# EAGLE design A20_Linux (EAGLE 6.5.0)
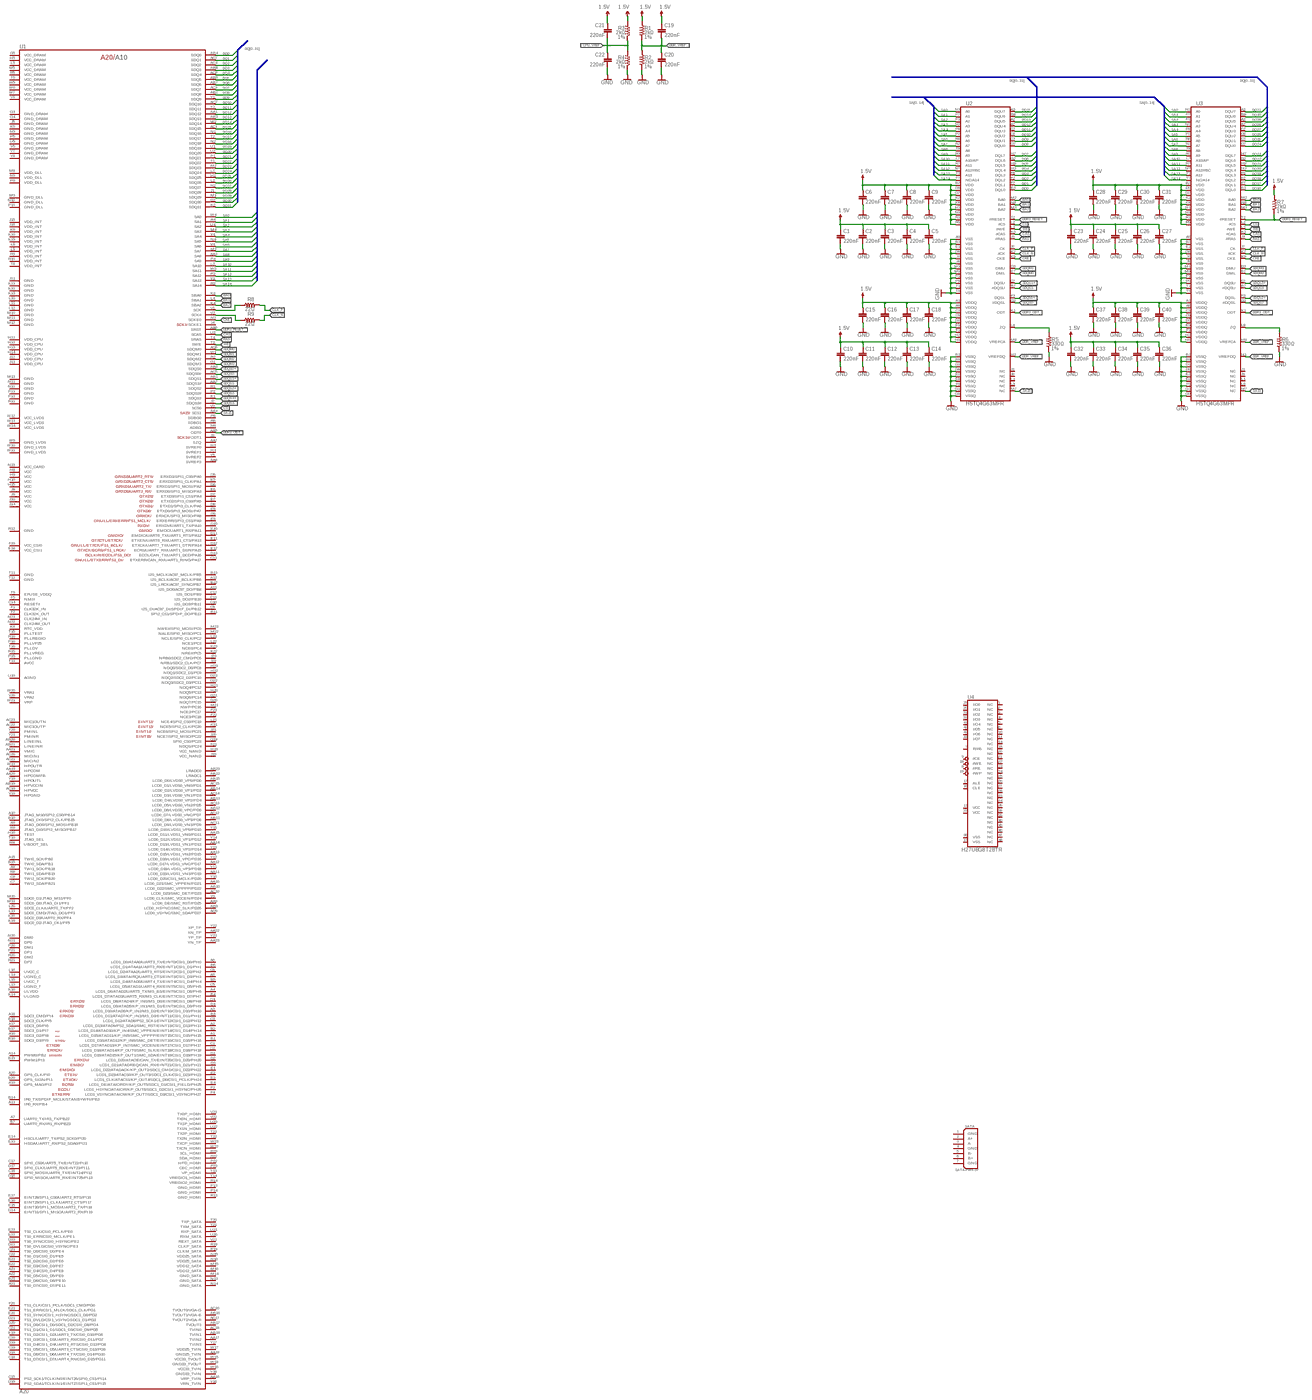
[diagram p0: schematic, sheet 1, overview]
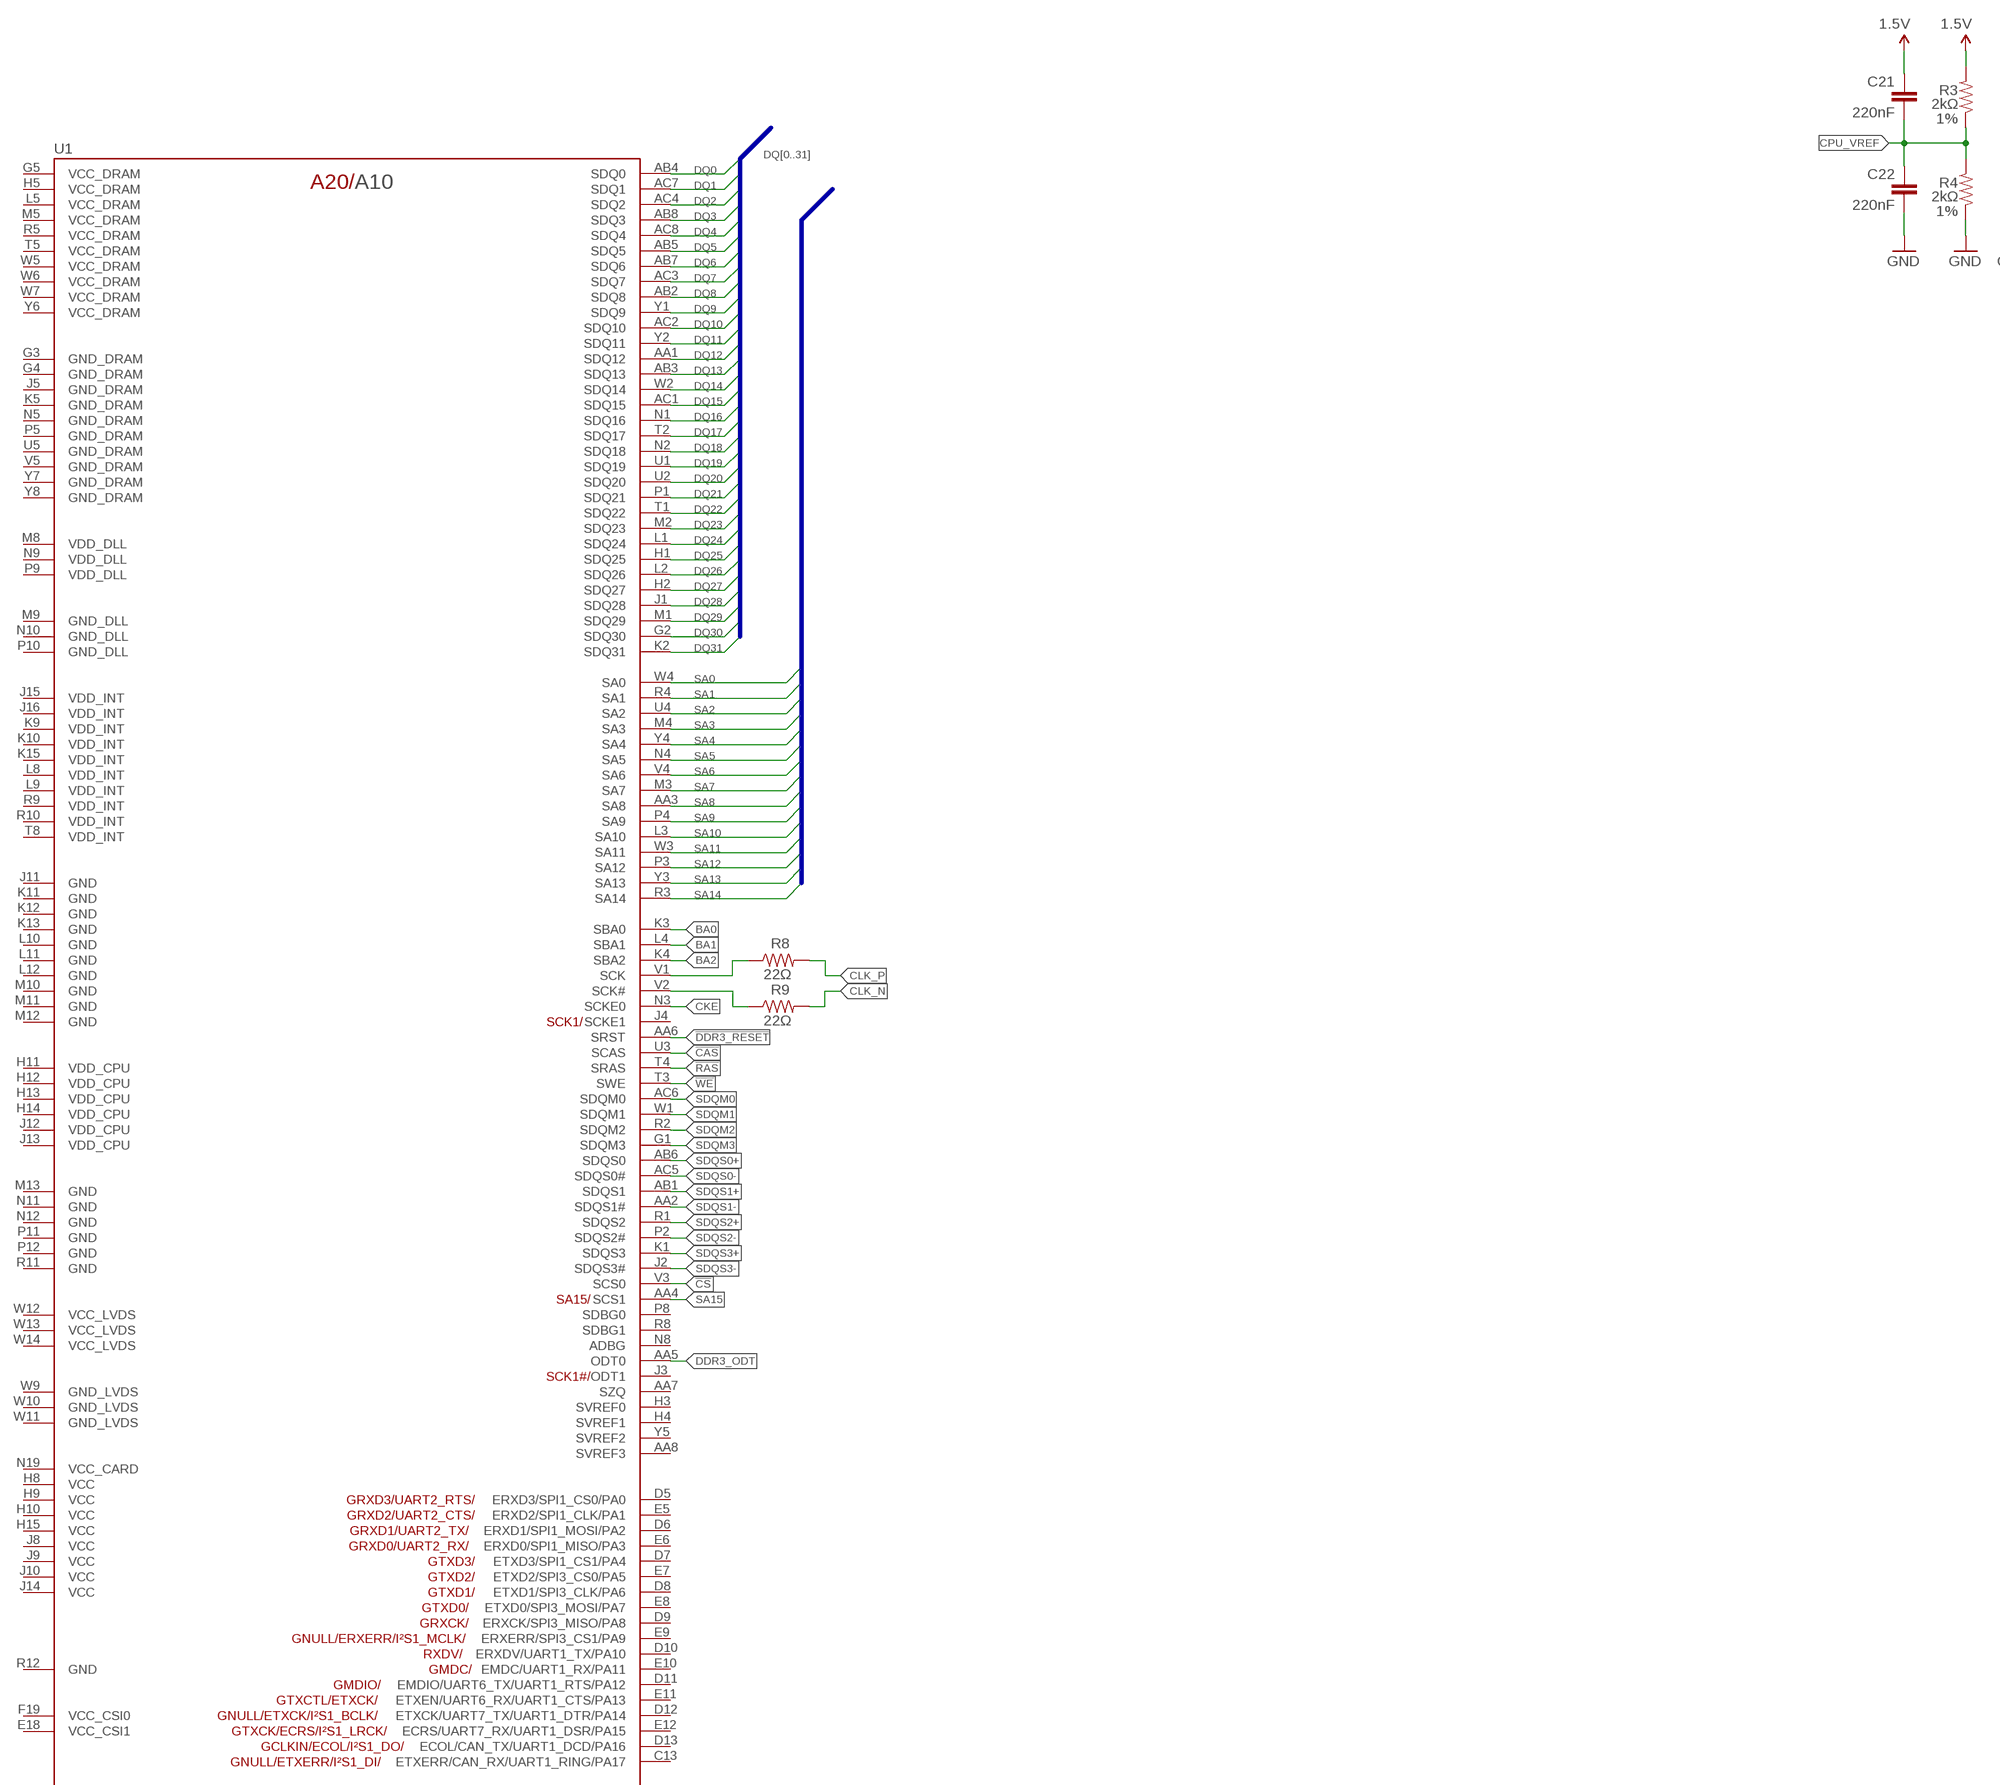
[diagram p1: schematic, sheet 1, part 1 of 4]
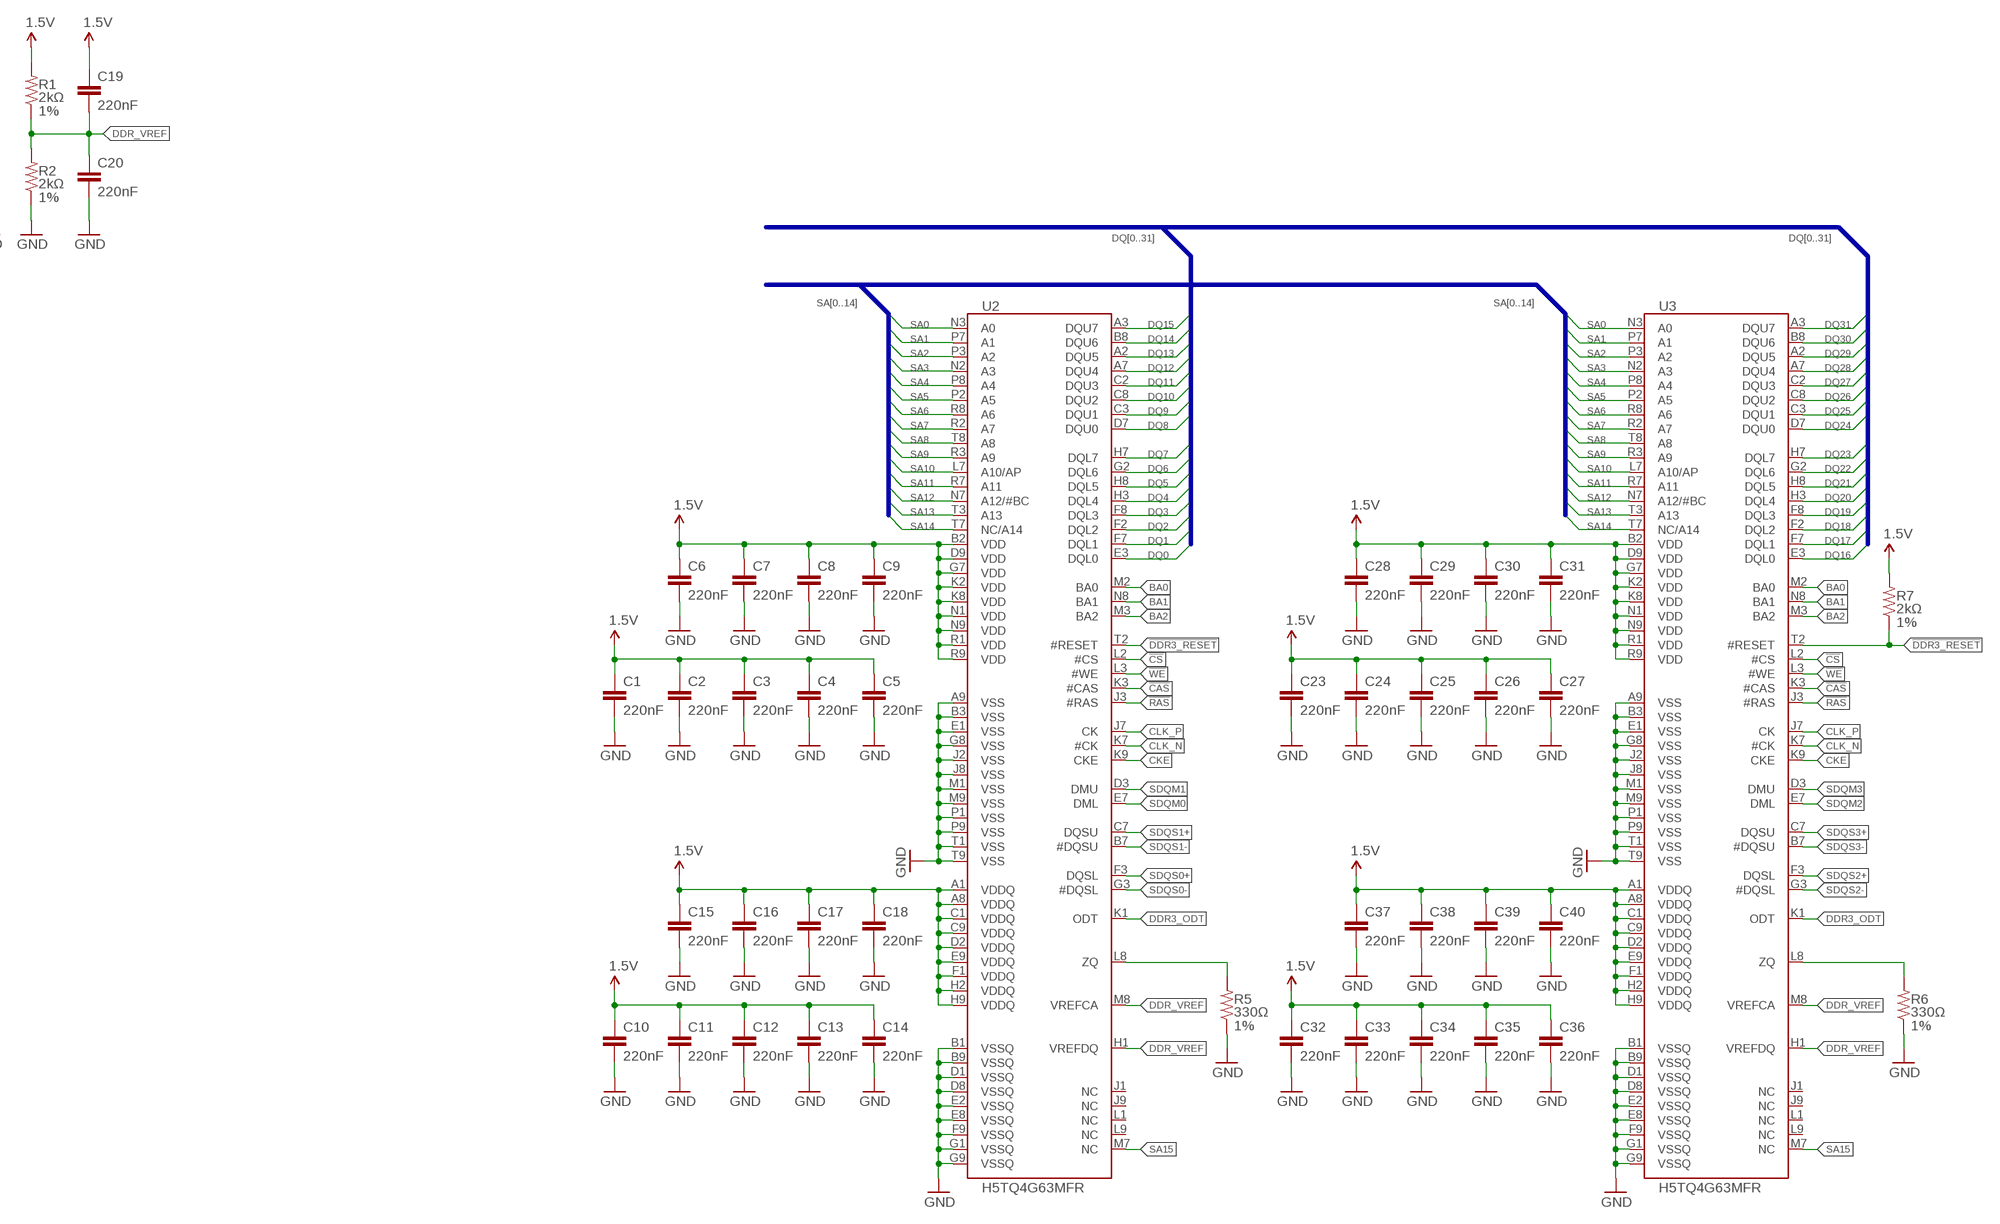
[diagram p2: schematic, sheet 1, part 2 of 4]
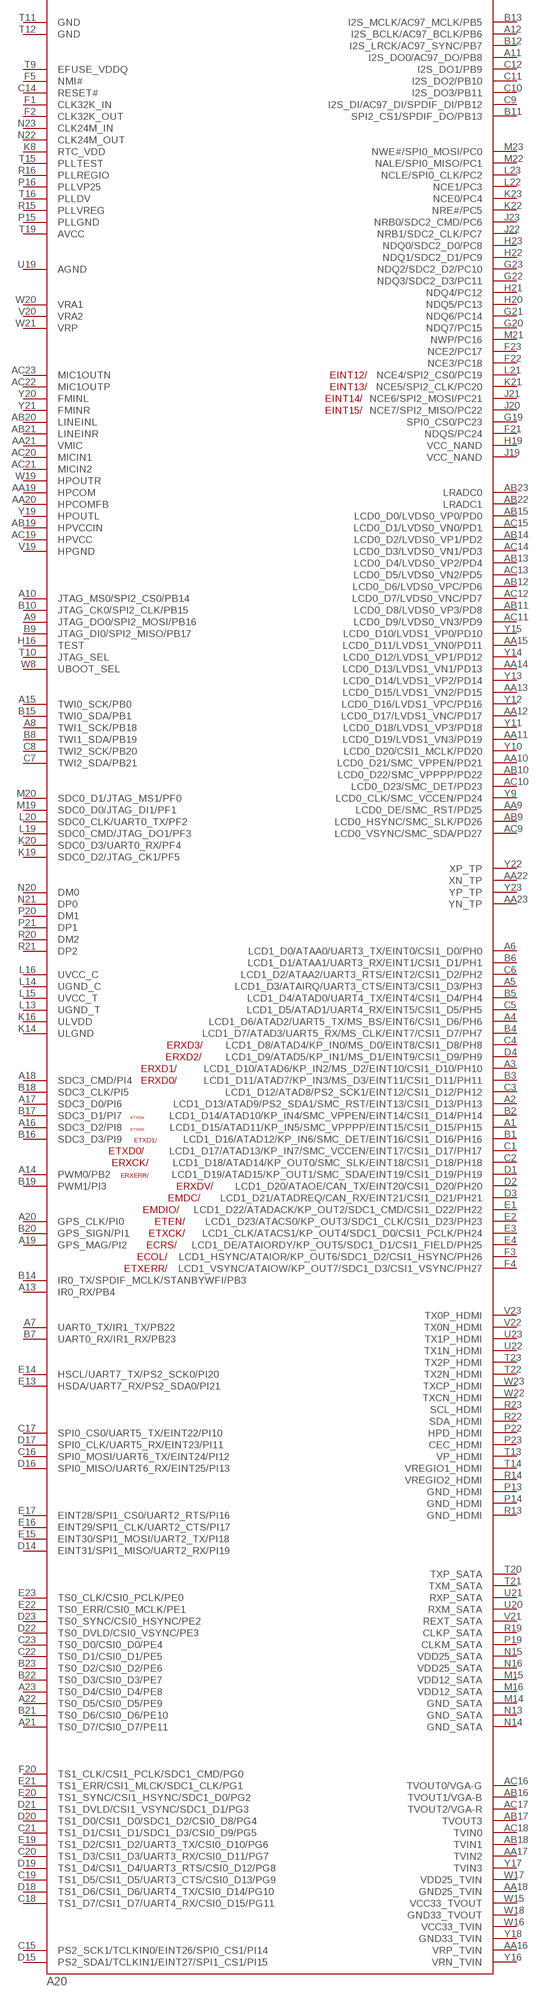
[diagram p3: schematic, sheet 1, part 3 of 4]
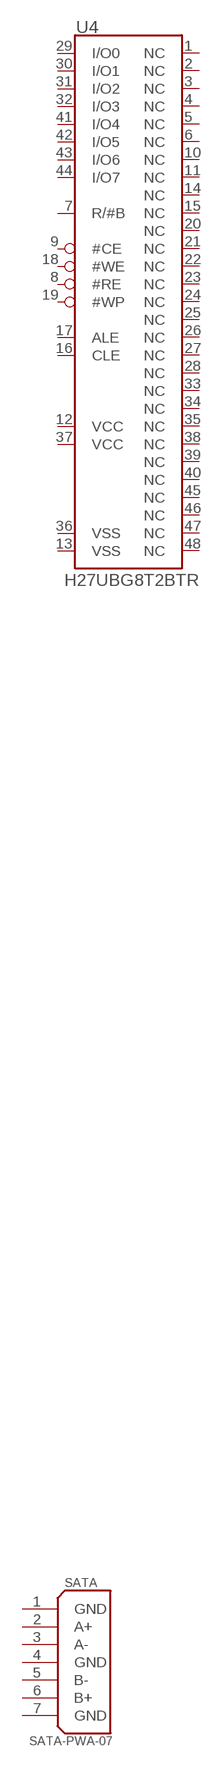
[diagram p4: schematic, sheet 1, part 4 of 4]

## Parts
C1  220nF  CAP0805  [0805]
C2  220nF  CAP0805  [0805]
C3  220nF  CAP0805  [0805]
C4  220nF  CAP0805  [0805]
C5  220nF  CAP0805  [0805]
C6  220nF  CAP0805  [0805]
C7  220nF  CAP0805  [0805]
C8  220nF  CAP0805  [0805]
C9  220nF  CAP0805  [0805]
C10  220nF  CAP0805  [0805]
C11  220nF  CAP0805  [0805]
C12  220nF  CAP0805  [0805]
C13  220nF  CAP0805  [0805]
C14  220nF  CAP0805  [0805]
C15  220nF  CAP0805  [0805]
C16  220nF  CAP0805  [0805]
C17  220nF  CAP0805  [0805]
C18  220nF  CAP0805  [0805]
C19  220nF  CAP0805  [0805]
C20  220nF  CAP0805  [0805]
C21  220nF  CAP0805  [0805]
C22  220nF  CAP0805  [0805]
C23  220nF  CAP0805  [0805]
C24  220nF  CAP0805  [0805]
C25  220nF  CAP0805  [0805]
C26  220nF  CAP0805  [0805]
C27  220nF  CAP0805  [0805]
C28  220nF  CAP0805  [0805]
C29  220nF  CAP0805  [0805]
C30  220nF  CAP0805  [0805]
C31  220nF  CAP0805  [0805]
C32  220nF  CAP0805  [0805]
C33  220nF  CAP0805  [0805]
C34  220nF  CAP0805  [0805]
C35  220nF  CAP0805  [0805]
C36  220nF  CAP0805  [0805]
C37  220nF  CAP0805  [0805]
C38  220nF  CAP0805  [0805]
C39  220nF  CAP0805  [0805]
C40  220nF  CAP0805  [0805]
R1  2kΩ  RESISTOR0805-RES  [0805]
R2  2kΩ  RESISTOR0805-RES  [0805]
R3  2kΩ  RESISTOR0805-RES  [0805]
R4  2kΩ  RESISTOR0805-RES  [0805]
R5  330Ω  RESISTOR0805-RES  [0805]
R6  330Ω  RESISTOR0805-RES  [0805]
R7  2kΩ  RESISTOR0805-RES  [0805]
R8  22Ω  RESISTOR  [0402-RES]
R9  22Ω  RESISTOR  [0402-RES]
SATA  SATA-PWA-07  [SATA-PWA-07]
U1  A20  A10  [TFBGA441]
U2  H5TQ4G63MFR  H5TQ2G63BFR_MEM4G16D3EABG-125HYNIX  [FBGA96_SK]
U3  H5TQ4G63MFR  H5TQ2G63BFR_MEM4G16D3EABG-125HYNIX  [FBGA96_SK]
U4  H27UBG8T2BTR  H27UBG8T2A  [TSOP48]

## Nets
1.5V: C1.1 C2.1 C3.1 C4.1 C5.1 C6.1 C7.1 C8.1 C9.1 C10.1 C11.1 C12.1 C13.1 C14.1 C15.1 C16.1 C17.1 C18.1 C19.1 C21.1 C23.1 C24.1 C25.1 C26.1 C27.1 C28.1 C29.1 C30.1 C31.1 C32.1 C33.1 C34.1 C35.1 C36.1 C37.1 C38.1 C39.1 C40.1 R1.2 R3.2 R7.2 U2.A1(VDDQ) U2.A8(VDDQ) U2.B2(VDD) U2.C1(VDDQ) U2.C9(VDDQ) U2.D2(VDDQ) U2.D9(VDD) U2.E9(VDDQ) U2.F1(VDDQ) U2.G7(VDD) U2.H2(VDDQ) U2.H9(VDDQ) U2.K2(VDD) U2.K8(VDD) U2.N1(VDD) U2.N9(VDD) U2.R1(VDD) U2.R9(VDD) U3.A1(VDDQ) U3.A8(VDDQ) U3.B2(VDD) U3.C1(VDDQ) U3.C9(VDDQ) U3.D2(VDDQ) U3.D9(VDD) U3.E9(VDDQ) U3.F1(VDDQ) U3.G7(VDD) U3.H2(VDDQ) U3.H9(VDDQ) U3.K2(VDD) U3.K8(VDD) U3.N1(VDD) U3.N9(VDD) U3.R1(VDD) U3.R9(VDD)
!CAS: U1.U3(SCAS) U2.K3(#CAS) U3.K3(#CAS)
!CS: U1.V3(SCS0) U2.L2(#CS) U3.L2(#CS)
!DDR3_RESET: R7.1 U1.AA6(SRST) U2.T2(#RESET) U3.T2(#RESET)
!RAS: U1.T4(SRAS) U2.J3(#RAS) U3.J3(#RAS)
!WE: U1.T3(SWE) U2.L3(#WE) U3.L3(#WE)
_CLK_N: R9.1 U1.V2(SCK#)
_CLK_P: R8.1 U1.V1(SCK)
BA0: U1.K3(SBA0) U2.M2(BA0) U3.M2(BA0)
BA1: U1.L4(SBA1) U2.N8(BA1) U3.N8(BA1)
BA2: U1.K4(SBA2) U2.M3(BA2) U3.M3(BA2)
CKE: U1.N3(SCKE0) U2.K9(CKE) U3.K9(CKE)
CLK_N: R9.2 U2.K7(#CK) U3.K7(#CK)
CLK_P: R8.2 U2.J7(CK) U3.J7(CK)
CPU_VREF: C21.2 C22.1 R3.1 R4.2
DDR3_ODT: U1.AA5(ODT0) U2.K1(ODT) U3.K1(ODT)
DDR_VREF: C19.2 C20.1 R1.1 R2.2 U2.H1(VREFDQ) U2.M8(VREFCA) U3.H1(VREFDQ) U3.M8(VREFCA)
DQ0: U1.AB4(SDQ0) U2.E3(DQL0)
DQ1: U1.AC7(SDQ1) U2.F7(DQL1)
DQ2: U1.AC4(SDQ2) U2.F2(DQL2)
DQ3: U1.AB8(SDQ3) U2.F8(DQL3)
DQ4: U1.AC8(SDQ4) U2.H3(DQL4)
DQ5: U1.AB5(SDQ5) U2.H8(DQL5)
DQ6: U1.AB7(SDQ6) U2.G2(DQL6)
DQ7: U1.AC3(SDQ7) U2.H7(DQL7)
DQ8: U1.AB2(SDQ8) U2.D7(DQU0)
DQ9: U1.Y1(SDQ9) U2.C3(DQU1)
DQ10: U1.AC2(SDQ10) U2.C8(DQU2)
DQ11: U1.Y2(SDQ11) U2.C2(DQU3)
DQ12: U1.AA1(SDQ12) U2.A7(DQU4)
DQ13: U1.AB3(SDQ13) U2.A2(DQU5)
DQ14: U1.W2(SDQ14) U2.B8(DQU6)
DQ15: U1.AC1(SDQ15) U2.A3(DQU7)
DQ16: U1.N1(SDQ16) U3.E3(DQL0)
DQ17: U1.T2(SDQ17) U3.F7(DQL1)
DQ18: U1.N2(SDQ18) U3.F2(DQL2)
DQ19: U1.U1(SDQ19) U3.F8(DQL3)
DQ20: U1.U2(SDQ20) U3.H3(DQL4)
DQ21: U1.P1(SDQ21) U3.H8(DQL5)
DQ22: U1.T1(SDQ22) U3.G2(DQL6)
DQ23: U1.M2(SDQ23) U3.H7(DQL7)
DQ24: U1.L1(SDQ24) U3.D7(DQU0)
DQ25: U1.H1(SDQ25) U3.C3(DQU1)
DQ26: U1.L2(SDQ26) U3.C8(DQU2)
DQ27: U1.H2(SDQ27) U3.C2(DQU3)
DQ28: U1.J1(SDQ28) U3.A7(DQU4)
DQ29: U1.M1(SDQ29) U3.A2(DQU5)
DQ30: U1.G2(SDQ30) U3.B8(DQU6)
DQ31: U1.K2(SDQ31) U3.A3(DQU7)
GND: C1.2 C2.2 C3.2 C4.2 C5.2 C6.2 C7.2 C8.2 C9.2 C10.2 C11.2 C12.2 C13.2 C14.2 C15.2 C16.2 C17.2 C18.2 C20.2 C22.2 C23.2 C24.2 C25.2 C26.2 C27.2 C28.2 C29.2 C30.2 C31.2 C32.2 C33.2 C34.2 C35.2 C36.2 C37.2 C38.2 C39.2 C40.2 R2.1 R4.1 R5.1 R6.1 U2.A9(VSS) U2.B1(VSSQ) U2.B3(VSS) U2.B9(VSSQ) U2.D1(VSSQ) U2.D8(VSSQ) U2.E1(VSS) U2.E2(VSSQ) U2.E8(VSSQ) U2.F9(VSSQ) U2.G1(VSSQ) U2.G8(VSS) U2.G9(VSSQ) U2.J2(VSS) U2.J8(VSS) U2.M1(VSS) U2.M9(VSS) U2.P1(VSS) U2.P9(VSS) U2.T1(VSS) U2.T9(VSS) U3.A9(VSS) U3.B1(VSSQ) U3.B3(VSS) U3.B9(VSSQ) U3.D1(VSSQ) U3.D8(VSSQ) U3.E1(VSS) U3.E2(VSSQ) U3.E8(VSSQ) U3.F9(VSSQ) U3.G1(VSSQ) U3.G8(VSS) U3.G9(VSSQ) U3.J2(VSS) U3.J8(VSS) U3.M1(VSS) U3.M9(VSS) U3.P1(VSS) U3.P9(VSS) U3.T1(VSS) U3.T9(VSS)
N$1: R5.2 U2.L8(ZQ)
N$2: R6.2 U3.L8(ZQ)
SA0: U1.W4(SA0) U2.N3(A0) U3.N3(A0)
SA1: U1.R4(SA1) U2.P7(A1) U3.P7(A1)
SA2: U1.U4(SA2) U2.P3(A2) U3.P3(A2)
SA3: U1.M4(SA3) U2.N2(A3) U3.N2(A3)
SA4: U1.Y4(SA4) U2.P8(A4) U3.P8(A4)
SA5: U1.N4(SA5) U2.P2(A5) U3.P2(A5)
SA6: U1.V4(SA6) U2.R8(A6) U3.R8(A6)
SA7: U1.M3(SA7) U2.R2(A7) U3.R2(A7)
SA8: U1.AA3(SA8) U2.T8(A8) U3.T8(A8)
SA9: U1.P4(SA9) U2.R3(A9) U3.R3(A9)
SA10: U1.L3(SA10) U2.L7(A10/AP) U3.L7(A10/AP)
SA11: U1.W3(SA11) U2.R7(A11) U3.R7(A11)
SA12: U1.P3(SA12) U2.N7(A12/#BC) U3.N7(A12/#BC)
SA13: U1.Y3(SA13) U2.T3(A13) U3.T3(A13)
SA14: U1.R3(SA14) U2.T7(NC/A14) U3.T7(NC/A14)
SA15: U1.AA4(SCS1) U2.M7(NC) U3.M7(NC)
SDQM0: U1.AC6(SDQM0) U2.E7(DML)
SDQM1: U1.W1(SDQM1) U2.D3(DMU)
SDQM2: U1.R2(SDQM2) U3.E7(DML)
SDQM3: U1.G1(SDQM3) U3.D3(DMU)
SDQS0+: U1.AB6(SDQS0) U2.F3(DQSL)
SDQS0-: U1.AC5(SDQS0#) U2.G3(#DQSL)
SDQS1+: U1.AB1(SDQS1) U2.C7(DQSU)
SDQS1-: U1.AA2(SDQS1#) U2.B7(#DQSU)
SDQS2+: U1.R1(SDQS2) U3.F3(DQSL)
SDQS2-: U1.P2(SDQS2#) U3.G3(#DQSL)
SDQS3+: U1.K1(SDQS3) U3.C7(DQSU)
SDQS3-: U1.J2(SDQS3#) U3.B7(#DQSU)
Unconnected: SATA.2(A+) SATA.3(A-) SATA.5(B-) SATA.6(B+) U1.A1(LCD1_D15/ATAD11/KP_IN5/SMC_VPPPP/EINT15/CSI1_D15/PH15) U1.A2(LCD1_D13/ATAD9/PS2_SDA1/SMC_RST/EINT13/CSI1_D13/PH13) U1.A3(LCD1_D10/ATAD6/KP_IN2/MS_D2/EINT10/CSI1_D10/PH10) U1.A4(LCD1_D6/ATAD2/UART5_TX/MS_BS/EINT6/CSI1_D6/PH6) U1.A5(LCD1_D3/ATAIRQ/UART3_CTS/EINT3/CSI1_D3/PH3) U1.A6(LCD1_D0/ATAA0/UART3_TX/EINT0/CSI1_D0/PH0) U1.A7(UART0_TX/IR1_TX/PB22) U1.A8(TWI1_SCK/PB18) U1.A9(JTAG_DO0/SPI2_MOSI/PB16) U1.A10(JTAG_MS0/SPI2_CS0/PB14) U1.A11(I2S_DO0/AC97_DO/PB8) U1.A12(I2S_BCLK/AC97_BCLK/PB6) U1.A13(IR0_RX/PB4) U1.A14(PWM0/PB2) U1.A15(TWI0_SCK/PB0) U1.A16(SDC3_D2/PI8) U1.A17(SDC3_D0/PI6) U1.A18(SDC3_CMD/PI4) U1.A19(GPS_MAG/PI2) U1.A20(GPS_CLK/PI0) U1.A21(TS0_D7/CSI0_D7/PE11) U1.A22(TS0_D5/CSI0_D5/PE9) U1.A23(TS0_D4/CSI0_D4/PE8) U1.AA7(SZQ) U1.AA8(SVREF3) U1.AA9(LCD0_DE/SMC_RST/PD25) U1.AA10(LCD0_D21/SMC_VPPEN/PD21) U1.AA11(LCD0_D19/LVDS1_VN3/PD19) U1.AA12(LCD0_D17/LVDS1_VNC/PD17) U1.AA13(LCD0_D15/LVDS1_VN2/PD15) U1.AA14(LCD0_D13/LVDS1_VN1/PD13) U1.AA15(LCD0_D11/LVDS1_VN0/PD11) U1.AA16(VRP_TVIN) U1.AA17(TVIN2) U1.AA18(GND25_TVIN) U1.AA19(HPCOM) U1.AA20(HPCOMFB) U1.AA21(VMIC) U1.AA22(XN_TP) U1.AA23(YN_TP) U1.AB9(LCD0_HSYNC/SMC_SLK/PD26) U1.AB10(LCD0_D22/SMC_VPPPP/PD22) U1.AB11(LCD0_D8/LVDS0_VP3/PD8) U1.AB12(LCD0_D6/LVDS0_VPC/PD6) U1.AB13(LCD0_D4/LVDS0_VP2/PD4) U1.AB14(LCD0_D2/LVDS0_VP1/PD2) U1.AB15(LCD0_D0/LVDS0_VP0/PD0) U1.AB16(TVOUT1/VGA-B) U1.AB17(TVOUT3) U1.AB18(TVIN1) U1.AB19(HPVCCIN) U1.AB20(LINEINL) U1.AB21(LINEINR) U1.AB22(LRADC1) U1.AB23(LRADC0) U1.AC9(LCD0_VSYNC/SMC_SDA/PD27) U1.AC10(LCD0_D23/SMC_DET/PD23) U1.AC11(LCD0_D9/LVDS0_VN3/PD9) U1.AC12(LCD0_D7/LVDS0_VNC/PD7) U1.AC13(LCD0_D5/LVDS0_VN2/PD5) U1.AC14(LCD0_D3/LVDS0_VN1/PD3) U1.AC15(LCD0_D1/LVDS0_VN0/PD1) U1.AC16(TVOUT0/VGA-G) U1.AC17(TVOUT2/VGA-R) U1.AC18(TVIN0) U1.AC19(HPVCC) U1.AC20(MICIN1) U1.AC21(MICIN2) U1.AC22(MIC1OUTP) U1.AC23(MIC1OUTN) U1.B1(LCD1_D16/ATAD12/KP_IN6/SMC_DET/EINT16/CSI1_D16/PH16) U1.B2(LCD1_D14/ATAD10/KP_IN4/SMC_VPPEN/EINT14/CSI1_D14/PH14) U1.B3(LCD1_D11/ATAD7/KP_IN3/MS_D3/EINT11/CSI1_D11/PH11) U1.B4(LCD1_D7/ATAD3/UART5_RX/MS_CLK/EINT7/CSI1_D7/PH7) U1.B5(LCD1_D4/ATAD0/UART4_TX/EINT4/CSI1_D4/PH4) U1.B6(LCD1_D1/ATAA1/UART3_RX/EINT1/CSI1_D1/PH1) U1.B7(UART0_RX/IR1_RX/PB23) U1.B8(TWI1_SDA/PB19) U1.B9(JTAG_DI0/SPI2_MISO/PB17) U1.B10(JTAG_CK0/SPI2_CLK/PB15) U1.B11(SPI2_CS1/SPDIF_DO/PB13) U1.B12(I2S_LRCK/AC97_SYNC/PB7) U1.B13(I2S_MCLK/AC97_MCLK/PB5) U1.B14(IR0_TX/SPDIF_MCLK/STANBYWFI/PB3) U1.B15(TWI0_SDA/PB1) U1.B16(SDC3_D3/PI9) U1.B17(SDC3_D1/PI7) U1.B18(SDC3_CLK/PI5) U1.B19(PWM1/PI3) U1.B20(GPS_SIGN/PI1) U1.B21(TS0_D6/CSI0_D6/PE10) U1.B22(TS0_D3/CSI0_D3/PE7) U1.B23(TS0_D2/CSI0_D2/PE6) U1.C1(LCD1_D17/ATAD13/KP_IN7/SMC_VCCEN/EINT17/CSI1_D17/PH17) U1.C2(LCD1_D18/ATAD14/KP_OUT0/SMC_SLK/EINT18/CSI1_D18/PH18) U1.C3(LCD1_D12/ATAD8/PS2_SCK1/EINT12/CSI1_D12/PH12) U1.C4(LCD1_D8/ATAD4/KP_IN0/MS_D0/EINT8/CSI1_D8/PH8) U1.C5(LCD1_D5/ATAD1/UART4_RX/EINT5/CSI1_D5/PH5) U1.C6(LCD1_D2/ATAA2/UART3_RTS/EINT2/CSI1_D2/PH2) U1.C7(TWI2_SDA/PB21) U1.C8(TWI2_SCK/PB20) U1.C9(I2S_DI/AC97_DI/SPDIF_DI/PB12) U1.C10(I2S_DO3/PB11) U1.C11(I2S_DO2/PB10) U1.C12(I2S_DO1/PB9) U1.C13(ETXERR/CAN_RX/UART1_RING/PA17) U1.C14(RESET#) U1.C15(PS2_SCK1/TCLKIN0/EINT26/SPI0_CS1/PI14) U1.C16(SPI0_MOSI/UART6_TX/EINT24/PI12) U1.C17(SPI0_CS0/UART5_TX/EINT22/PI10) U1.C18(TS1_D7/CSI1_D7/UART4_RX/CSI0_D15/PG11) U1.C19(TS1_D5/CSI1_D5/UART3_CTS/CSI0_D13/PG9) U1.C20(TS1_D3/CSI1_D3/UART3_RX/CSI0_D11/PG7) U1.C21(TS1_D1/CSI1_D1/SDC1_D3/CSI0_D9/PG5) U1.C22(TS0_D1/CSI0_D1/PE5) U1.C23(TS0_D0/CSI0_D0/PE4) U1.D1(LCD1_D19/ATAD15/KP_OUT1/SMC_SDA/EINT19/CSI1_D19/PH19) U1.D2(LCD1_D20/ATAOE/CAN_TX/EINT20/CSI1_D20/PH20) U1.D3(LCD1_D21/ATADREQ/CAN_RX/EINT21/CSI1_D21/PH21) U1.D4(LCD1_D9/ATAD5/KP_IN1/MS_D1/EINT9/CSI1_D9/PH9) U1.D5(ERXD3/SPI1_CS0/PA0) U1.D6(ERXD1/SPI1_MOSI/PA2) U1.D7(ETXD3/SPI1_CS1/PA4) U1.D8(ETXD1/SPI3_CLK/PA6) U1.D9(ERXCK/SPI3_MISO/PA8) U1.D10(ERXDV/UART1_TX/PA10) U1.D11(EMDIO/UART6_TX/UART1_RTS/PA12) U1.D12(ETXCK/UART7_TX/UART1_DTR/PA14) U1.D13(ECOL/CAN_TX/UART1_DCD/PA16) U1.D14(EINT31/SPI1_MISO/UART2_RX/PI19) U1.D15(PS2_SDA1/TCLKIN1/EINT27/SPI1_CS1/PI15) U1.D16(SPI0_MISO/UART6_RX/EINT25/PI13) U1.D17(SPI0_CLK/UART5_RX/EINT23/PI11) U1.D18(TS1_D6/CSI1_D6/UART4_TX/CSI0_D14/PG10) U1.D19(TS1_D4/CSI1_D4/UART3_RTS/CSI0_D12/PG8) U1.D20(TS1_D0/CSI1_D0/SDC1_D2/CSI0_D8/PG4) U1.D21(TS1_DVLD/CSI1_VSYNC/SDC1_D1/PG3) U1.D22(TS0_DVLD/CSI0_VSYNC/PE3) U1.D23(TS0_SYNC/CSI0_HSYNC/PE2) U1.E1(LCD1_D22/ATADACK/KP_OUT2/SDC1_CMD/CSI1_D22/PH22) U1.E2(LCD1_D23/ATACS0/KP_OUT3/SDC1_CLK/CSI1_D23/PH23) U1.E3(LCD1_CLK/ATACS1/KP_OUT4/SDC1_D0/CSI1_PCLK/PH24) U1.E4(LCD1_DE/ATAIORDY/KP_OUT5/SDC1_D1/CSI1_FIELD/PH25) U1.E5(ERXD2/SPI1_CLK/PA1) U1.E6(ERXD0/SPI1_MISO/PA3) U1.E7(ETXD2/SPI3_CS0/PA5) U1.E8(ETXD0/SPI3_MOSI/PA7) U1.E9(ERXERR/SPI3_CS1/PA9) U1.E10(EMDC/UART1_RX/PA11) U1.E11(ETXEN/UART6_RX/UART1_CTS/PA13) U1.E12(ECRS/UART7_RX/UART1_DSR/PA15) U1.E13(HSDA/UART7_RX/PS2_SDA0/PI21) U1.E14(HSCL/UART7_TX/PS2_SCK0/PI20) U1.E15(EINT30/SPI1_MOSI/UART2_TX/PI18) U1.E16(EINT29/SPI1_CLK/UART2_CTS/PI17) U1.E17(EINT28/SPI1_CS0/UART2_RTS/PI16) U1.E18(VCC_CSI1) U1.E19(TS1_D2/CSI1_D2/UART3_TX/CSI0_D10/PG6) U1.E20(TS1_SYNC/CSI1_HSYNC/SDC1_D0/PG2) U1.E21(TS1_ERR/CSI1_MLCK/SDC1_CLK/PG1) U1.E22(TS0_ERR/CSI0_MCLK/PE1) U1.E23(TS0_CLK/CSI0_PCLK/PE0) U1.F1(CLK32K_IN) U1.F2(CLK32K_OUT) U1.F3(LCD1_HSYNC/ATAIOR/KP_OUT6/SDC1_D2/CSI1_HSYNC/PH26) U1.F4(LCD1_VSYNC/ATAIOW/KP_OUT7/SDC1_D3/CSI1_VSYNC/PH27) U1.F5(NMI#) U1.F19(VCC_CSI0) U1.F20(TS1_CLK/CSI1_PCLK/SDC1_CMD/PG0) U1.F21(NDQS/PC24) U1.F22(NCE3/PC18) U1.F23(NCE2/PC17) U1.G3(GND_DRAM) U1.G4(GND_DRAM) U1.G5(VCC_DRAM) U1.G19(SPI0_CS0/PC23) U1.G20(NDQ7/PC15) U1.G21(NDQ6/PC14) U1.G22(NDQ3/SDC2_D3/PC11) U1.G23(NDQ2/SDC2_D2/PC10) U1.H3(SVREF0) U1.H4(SVREF1) U1.H5(VCC_DRAM) U1.H8(VCC) U1.H9(VCC) U1.H10(VCC) U1.H11(VDD_CPU) U1.H12(VDD_CPU) U1.H13(VDD_CPU) U1.H14(VDD_CPU) U1.H15(VCC) U1.H16(TEST) U1.H19(VCC_NAND) U1.H20(NDQ5/PC13) U1.H21(NDQ4/PC12) U1.H22(NDQ1/SDC2_D1/PC9) U1.H23(NDQ0/SDC2_D0/PC8) U1.J3(ODT1) U1.J4(SCKE1) U1.J5(GND_DRAM) U1.J8(VCC) U1.J9(VCC) U1.J10(VCC) U1.J11(GND) U1.J12(VDD_CPU) U1.J13(VDD_CPU) U1.J14(VCC) U1.J15(VDD_INT) U1.J16(VDD_INT) U1.J19(VCC_NAND) U1.J20(NCE7/SPI2_MISO/PC22) U1.J21(NCE6/SPI2_MOSI/PC21) U1.J22(NRB1/SDC2_CLK/PC7) U1.J23(NRB0/SDC2_CMD/PC6) U1.K5(GND_DRAM) U1.K8(RTC_VDD) U1.K9(VDD_INT) U1.K10(VDD_INT) U1.K11(GND) U1.K12(GND) U1.K13(GND) U1.K14(ULGND) U1.K15(VDD_INT) U1.K16(ULVDD) U1.K19(SDC0_D2/JTAG_CK1/PF5) U1.K20(SDC0_D3/UART0_RX/PF4) U1.K21(NCE5/SPI2_CLK/PC20) U1.K22(NRE#/PC5) U1.K23(NCE0/PC4) U1.L5(VCC_DRAM) U1.L8(VDD_INT) U1.L9(VDD_INT) U1.L10(GND) U1.L11(GND) U1.L12(GND) U1.L13(UGND_T) U1.L14(UGND_C) U1.L15(UVCC_T) U1.L16(UVCC_C) U1.L19(SDC0_CMD/JTAG_DO1/PF3) U1.L20(SDC0_CLK/UART0_TX/PF2) U1.L21(NCE4/SPI2_CS0/PC19) U1.L22(NCE1/PC3) U1.L23(NCLE/SPI0_CLK/PC2) U1.M5(VCC_DRAM) U1.M8(VDD_DLL) U1.M9(GND_DLL) U1.M10(GND) U1.M11(GND) U1.M12(GND) U1.M13(GND) U1.M14(GND_SATA) U1.M15(VDD12_SATA) U1.M16(VDD12_SATA) U1.M19(SDC0_D0/JTAG_DI1/PF1) U1.M20(SDC0_D1/JTAG_MS1/PF0) U1.M21(NWP/PC16) U1.M22(NALE/SPI0_MISO/PC1) U1.M23(NWE#/SPI0_MOSI/PC0) U1.N5(GND_DRAM) U1.N8(ADBG) U1.N9(VDD_DLL) U1.N10(GND_DLL) U1.N11(GND) U1.N12(GND) U1.N13(GND_SATA) U1.N14(GND_SATA) U1.N15(VDD25_SATA) U1.N16(VDD25_SATA) U1.N19(VCC_CARD) U1.N20(DM0) U1.N21(DP0) U1.N22(CLK24M_OUT) U1.N23(CLK24M_IN) U1.P5(GND_DRAM) U1.P8(SDBG0) U1.P9(VDD_DLL) U1.P10(GND_DLL) U1.P11(GND) U1.P12(GND) U1.P13(GND_HDMI) U1.P14(GND_HDMI) U1.P15(PLLGND) U1.P16(PLLVP25) U1.P19(CLKM_SATA) U1.P20(DM1) U1.P21(DP1) U1.P22(HPD_HDMI) U1.P23(CEC_HDMI) U1.R5(VCC_DRAM) U1.R8(SDBG1) U1.R9(VDD_INT) U1.R10(VDD_INT) U1.R11(GND) U1.R12(GND) U1.R13(GND_HDMI) U1.R14(VREGIO2_HDMI) U1.R15(PLLVREG) U1.R16(PLLREGIO) U1.R19(CLKP_SATA) U1.R20(DM2) U1.R21(DP2) U1.R22(SDA_HDMI) U1.R23(SCL_HDMI) U1.T5(VCC_DRAM) U1.T8(VDD_INT) U1.T9(EFUSE_VDDQ) U1.T10(JTAG_SEL) U1.T11(GND) U1.T12(GND) U1.T13(VP_HDMI) U1.T14(VREGIO1_HDMI) U1.T15(PLLTEST) U1.T16(PLLDV) U1.T19(AVCC) U1.T20(TXP_SATA) U1.T21(TXM_SATA) U1.T22(TX2N_HDMI) U1.T23(TX2P_HDMI) U1.U5(GND_DRAM) U1.U19(AGND) U1.U20(RXM_SATA) U1.U21(RXP_SATA) U1.U22(TX1N_HDMI) U1.U23(TX1P_HDMI) U1.V5(GND_DRAM) U1.V19(HPGND) U1.V20(VRA2) U1.V21(REXT_SATA) U1.V22(TX0N_HDMI) U1.V23(TX0P_HDMI) U1.W5(VCC_DRAM) U1.W6(VCC_DRAM) U1.W7(VCC_DRAM) U1.W8(UBOOT_SEL) U1.W9(GND_LVDS) U1.W10(GND_LVDS) U1.W11(GND_LVDS) U1.W12(VCC_LVDS) U1.W13(VCC_LVDS) U1.W14(VCC_LVDS) U1.W15(VCC33_TVOUT) U1.W16(VCC33_TVIN) U1.W17(VDD25_TVIN) U1.W18(GND33_TVOUT) U1.W19(HPOUTR) U1.W20(VRA1) U1.W21(VRP) U1.W22(TXCN_HDMI) U1.W23(TXCP_HDMI) U1.Y5(SVREF2) U1.Y6(VCC_DRAM) U1.Y7(GND_DRAM) U1.Y8(GND_DRAM) U1.Y9(LCD0_CLK/SMC_VCCEN/PD24) U1.Y10(LCD0_D20/CSI1_MCLK/PD20) U1.Y11(LCD0_D18/LVDS1_VP3/PD18) U1.Y12(LCD0_D16/LVDS1_VPC/PD16) U1.Y13(LCD0_D14/LVDS1_VP2/PD14) U1.Y14(LCD0_D12/LVDS1_VP1/PD12) U1.Y15(LCD0_D10/LVDS1_VP0/PD10) U1.Y16(VRN_TVIN) U1.Y17(TVIN3) U1.Y18(GND33_TVIN) U1.Y19(HPOUTL) U1.Y20(FMINL) U1.Y21(FMINR) U1.Y22(XP_TP) U1.Y23(YP_TP) U2.J1(NC) U2.J9(NC) U2.L1(NC) U2.L9(NC) U3.J1(NC) U3.J9(NC) U3.L1(NC) U3.L9(NC) U4.1(NC) U4.2(NC) U4.3(NC) U4.4(NC) U4.5(NC) U4.6(NC) U4.7(R/#B) U4.8(#RE) U4.9(#CE) U4.10(NC) U4.11(NC) U4.14(NC) U4.15(NC) U4.16(CLE) U4.17(ALE) U4.18(#WE) U4.19(#WP) U4.20(NC) U4.21(NC) U4.22(NC) U4.23(NC) U4.24(NC) U4.25(NC) U4.26(NC) U4.27(NC) U4.28(NC) U4.29(I/O0) U4.30(I/O1) U4.31(I/O2) U4.32(I/O3) U4.33(NC) U4.34(NC) U4.35(NC) U4.38(NC) U4.39(NC) U4.40(NC) U4.41(I/O4) U4.42(I/O5) U4.43(I/O6) U4.44(I/O7) U4.45(NC) U4.46(NC) U4.47(NC) U4.48(NC)

## Buses
SA[0..14]
DQ[0..31]

## Notes on the sheet
- 1% | 1%
- 1% | 1%
- 1%
- 1% | 1%

## Power pins joined to a net without a drawn wire
GND: SATA.1(GND) SATA.4(GND) SATA.7(GND)
VCC: U4.12(VCC) U4.37(VCC)
VSS: U4.13(VSS) U4.36(VSS)

## Library data of the parts
C1-C40 = SparkFun-Passives:CAP: Capacitor Standard 0603 ceramic capacitor, and 0.1" leaded capacitor.
R1-R7 = SparkFun-Passives:RESISTOR: Resistor Basic schematic elements and footprints for 0603, 1206, and PTH resistors.
R8 R9 = Passives:RESISTOR
SATA = OLIMEX_CONNECTORS:SATA-PWA-07
U1 = OLIMEX_IC:A10
U2 U3 = OLIMEX_IC:H5TQ2G63BFR_MEM4G16D3EABG-125
U4 = OLIMEX_IC:H27UBG8T2A

## Board
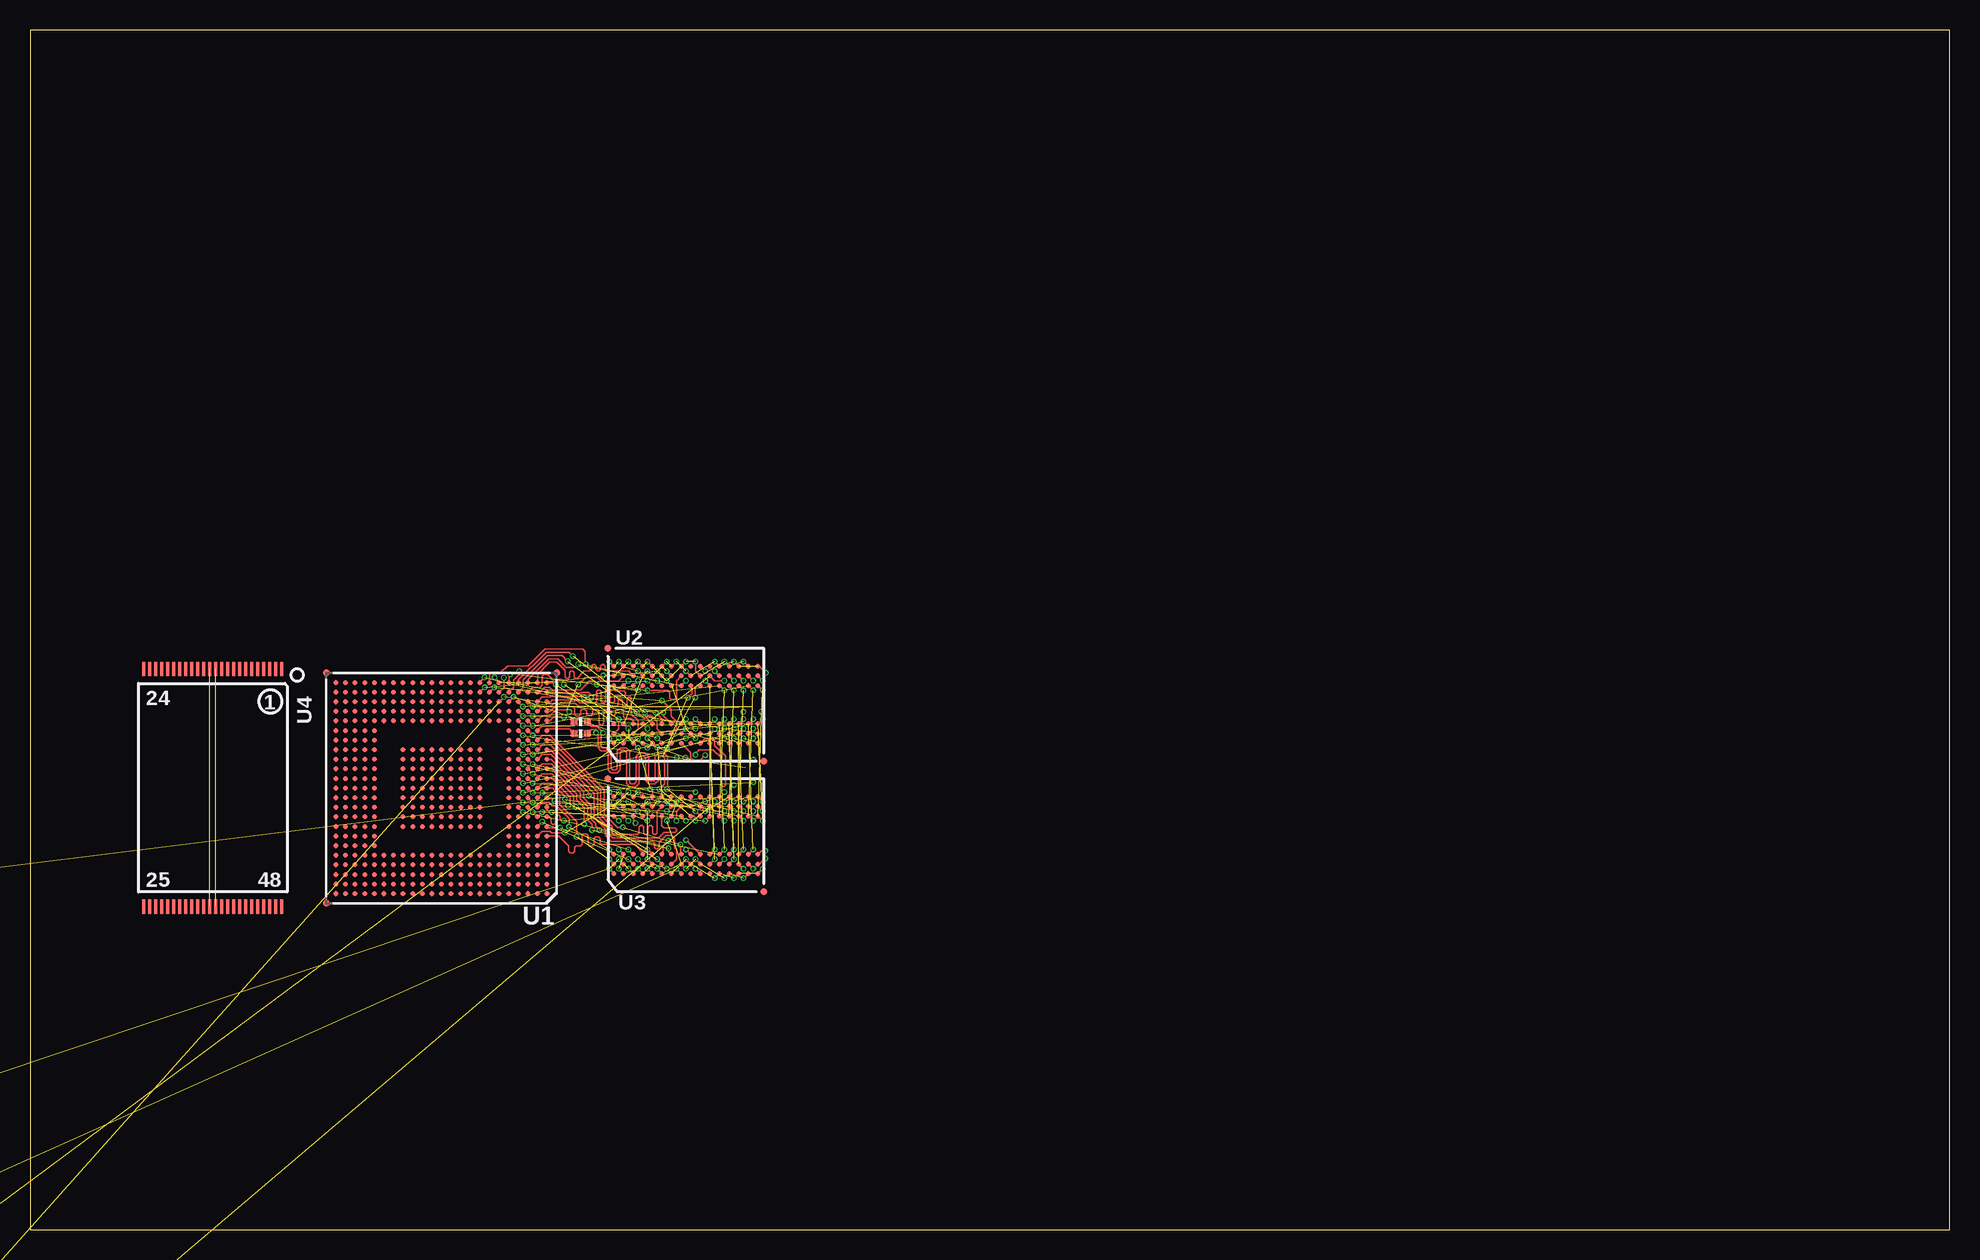
[diagram p5: board, top side]
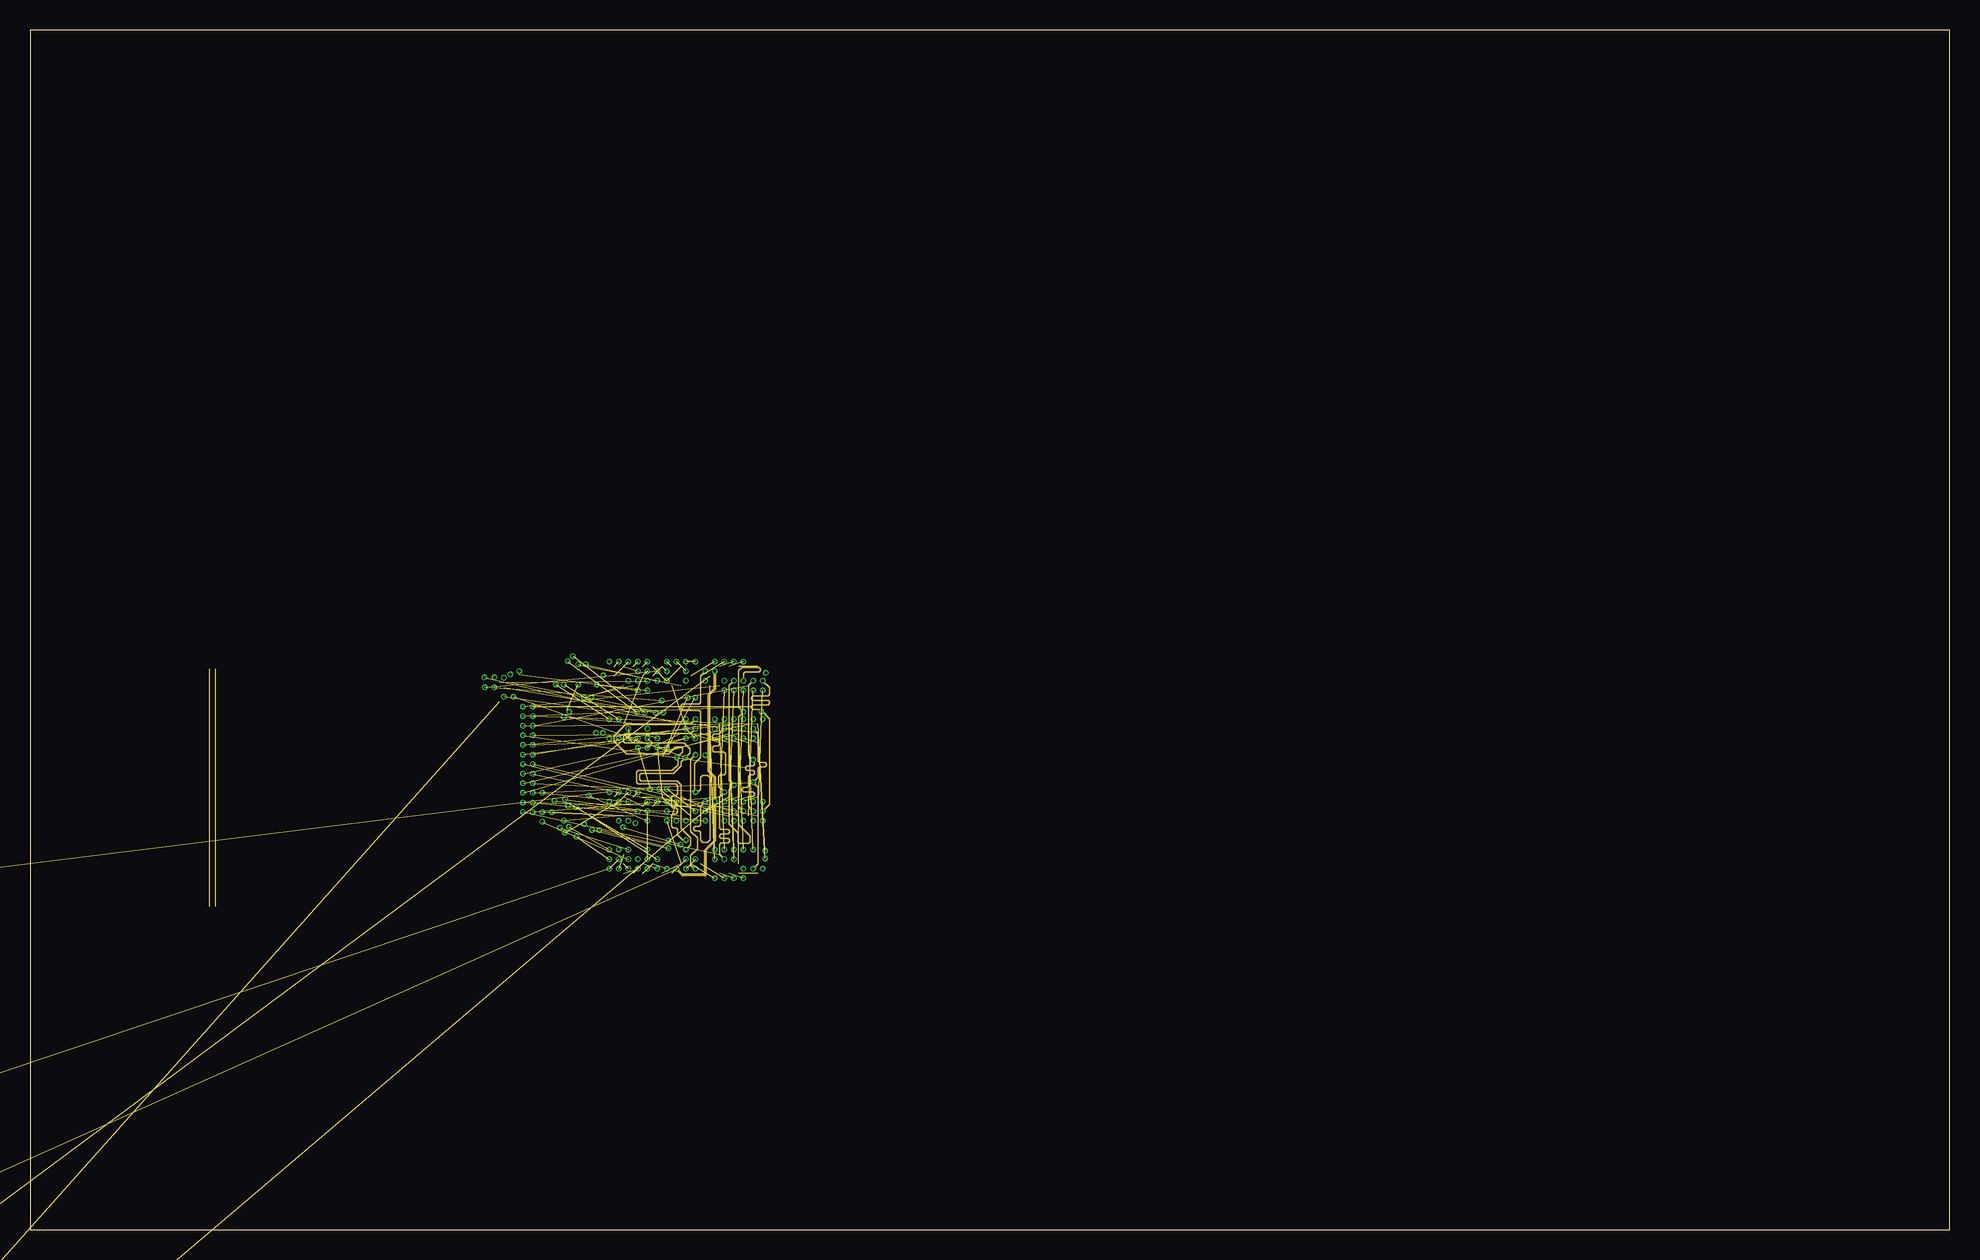
[diagram p6: board, inner layer Route2]

Size 160 x 100 mm. Coordinates in mm from the lower left corner, seen from the top.
Outline: 0,0 160,0 160,100 0,100 0,0
Copper layers (1*2*15*16): Top 0.035559375mm / dielectric 0.17018125mm / Route2 0.01778125mm / dielectric 47mil / Route15 0.01778125mm / dielectric 0.17018125mm / Bottom 0.035559375mm
Design rules "OSHPark-4layer *": minimum track width 5mil, minimum drill 10mil, track to track 4mil, track to pad 4mil, pad to pad 5mil, via to via 4mil, smd to smd 5mil, copper to edge 15mil, drill to drill 6mil, minimum pad ring 4mil, minimum via ring 4mil, stop-mask expansion 4mil, vias tented up to drill 20mil, thermal gap 10mil

### Footprints (pad centres in the part's own frame; a part is rotated, then mirrored left to right if it is on the bottom)
0805 = smd 0.8 x 1.2: 1 -0.9,0; 2 0.9,0
0402-RES = smd 0.6 x 0.6: 1 -0.55,0; 2 0.55,0
SATA-PWA-07 = smd 0.9 x 2.2: 1 -4.25,-4.8; 2 -2.98,-4.8; 3 -1.71,-4.8; 4 -0.44,-4.8; 5 0.83,-4.8; 6 2.1,-4.8; 7 3.37,-4.8 | drill 1.5: P$8 -6.81,-2.44; P$9 5.93,-2.44
TFBGA441 = smd 0.4 x 0.4: A1 -8.8,-8.8; A2 -8.8,-8; A3 -8.8,-7.2; A4 -8.8,-6.4; A5 -8.8,-5.6; A6 -8.8,-4.8; A7 -8.8,-4; A8 -8.8,-3.2; A9 -8.8,-2.4; A10 -8.8,-1.6; A11 -8.8,-0.8; A12 -8.8,0; A13 -8.8,0.8; A14 -8.8,1.6; A15 -8.8,2.4; A16 -8.8,3.2; A17 -8.8,4; A18 -8.8,4.8; A19 -8.8,5.6; A20 -8.8,6.4; A21 -8.8,7.2; A22 -8.8,8; A23 -8.8,8.8; AA1 7.2,-8.8; AA2 7.2,-8; AA3 7.2,-7.2; AA4 7.2,-6.4; AA5 7.2,-5.6; AA6 7.2,-4.8; AA7 7.2,-4; AA8 7.2,-3.2; AA9 7.2,-2.4; AA10 7.2,-1.6; AA11 7.2,-0.8; AA12 7.2,0; AA13 7.2,0.8; AA14 7.2,1.6; AA15 7.2,2.4; AA16 7.2,3.2; AA17 7.2,4; AA18 7.2,4.8; AA19 7.2,5.6; AA20 7.2,6.4; AA21 7.2,7.2; AA22 7.2,8; AA23 7.2,8.8; AB1 8,-8.8; AB2 8,-8; AB3 8,-7.2; AB4 8,-6.4; AB5 8,-5.6; AB6 8,-4.8; AB7 8,-4; AB8 8,-3.2; AB9 8,-2.4; AB10 8,-1.6; AB11 8,-0.8; AB12 8,0; AB13 8,0.8; AB14 8,1.6; AB15 8,2.4; AB16 8,3.2; AB17 8,4; AB18 8,4.8; AB19 8,5.6; AB20 8,6.4; AB21 8,7.2; AB22 8,8; AB23 8,8.8; AC1 8.8,-8.8; AC2 8.8,-8; AC3 8.8,-7.2; AC4 8.8,-6.4; AC5 8.8,-5.6; AC6 8.8,-4.8; AC7 8.8,-4; AC8 8.8,-3.2; AC9 8.8,-2.4; AC10 8.8,-1.6; AC11 8.8,-0.8; AC12 8.8,0; AC13 8.8,0.8; AC14 8.8,1.6; AC15 8.8,2.4; AC16 8.8,3.2; AC17 8.8,4; AC18 8.8,4.8; AC19 8.8,5.6; AC20 8.8,6.4; AC21 8.8,7.2; AC22 8.8,8; AC23 8.8,8.8; B1 -8,-8.8; B2 -8,-8; B3 -8,-7.2; B4 -8,-6.4; B5 -8,-5.6; B6 -8,-4.8; B7 -8,-4; B8 -8,-3.2; B9 -8,-2.4; B10 -8,-1.6; B11 -8,-0.8; B12 -8,0; B13 -8,0.8; B14 -8,1.6; B15 -8,2.4; B16 -8,3.2; B17 -8,4; B18 -8,4.8; B19 -8,5.6; B20 -8,6.4; B21 -8,7.2; B22 -8,8; B23 -8,8.8; C1 -7.2,-8.8; C2 -7.2,-8; C3 -7.2,-7.2; C4 -7.2,-6.4; C5 -7.2,-5.6; C6 -7.2,-4.8; C7 -7.2,-4; C8 -7.2,-3.2; C9 -7.2,-2.4; C10 -7.2,-1.6; C11 -7.2,-0.8; C12 -7.2,0; C13 -7.2,0.8; C14 -7.2,1.6; C15 -7.2,2.4; C16 -7.2,3.2; C17 -7.2,4; C18 -7.2,4.8; C19 -7.2,5.6; C20 -7.2,6.4; C21 -7.2,7.2; C22 -7.2,8; C23 -7.2,8.8; D1 -6.4,-8.8; D2 -6.4,-8; D3 -6.4,-7.2; D4 -6.4,-6.4; D5 -6.4,-5.6; D6 -6.4,-4.8; D7 -6.4,-4; D8 -6.4,-3.2; D9 -6.4,-2.4; D10 -6.4,-1.6; D11 -6.4,-0.8; D12 -6.4,0; D13 -6.4,0.8; D14 -6.4,1.6; D15 -6.4,2.4; D16 -6.4,3.2; D17 -6.4,4; D18 -6.4,4.8; D19 -6.4,5.6; D20 -6.4,6.4; D21 -6.4,7.2; D22 -6.4,8; D23 -6.4,8.8; E1 -5.6,-8.8; E2 -5.6,-8; E3 -5.6,-7.2; E4 -5.6,-6.4; E5 -5.6,-5.6; E6 -5.6,-4.8; E7 -5.6,-4; E8 -5.6,-3.2; E9 -5.6,-2.4; E10 -5.6,-1.6; E11 -5.6,-0.8; E12 -5.6,0; E13 -5.6,0.8; E14 -5.6,1.6; E15 -5.6,2.4; E16 -5.6,3.2; E17 -5.6,4; E18 -5.6,4.8; E19 -5.6,5.6; E20 -5.6,6.4; E21 -5.6,7.2; E22 -5.6,8; E23 -5.6,8.8; F1 -4.8,-8.8; F2 -4.8,-8; F3 -4.8,-7.2; F4 -4.8,-6.4; F5 -4.8,-5.6; F19 -4.8,5.6; F20 -4.8,6.4; F21 -4.8,7.2; F22 -4.8,8; F23 -4.8,8.8; G1 -4,-8.8; G2 -4,-8; G3 -4,-7.2; G4 -4,-6.4; G5 -4,-5.6; G19 -4,5.6; G20 -4,6.4; G21 -4,7.2; G22 -4,8; G23 -4,8.8; H1 -3.2,-8.8; H2 -3.2,-8; H3 -3.2,-7.2; H4 -3.2,-6.4; H5 -3.2,-5.6; H8 -3.2,-3.2; H9 -3.2,-2.4; H10 -3.2,-1.6; H11 -3.2,-0.8; H12 -3.2,0; H13 -3.2,0.8; H14 -3.2,1.6; H15 -3.2,2.4; H16 -3.2,3.2; H19 -3.2,5.6; H20 -3.2,6.4; H21 -3.2,7.2; H22 -3.2,8; H23 -3.2,8.8; J1 -2.4,-8.8; J2 -2.4,-8; J3 -2.4,-7.2; J4 -2.4,-6.4; J5 -2.4,-5.6; J8 -2.4,-3.2; J9 -2.4,-2.4; J10 -2.4,-1.6; J11 -2.4,-0.8; J12 -2.4,0; J13 -2.4,0.8; J14 -2.4,1.6; J15 -2.4,2.4; J16 -2.4,3.2; J19 -2.4,5.6; J20 -2.4,6.4; J21 -2.4,7.2; J22 -2.4,8; J23 -2.4,8.8; K1 -1.6,-8.8; K2 -1.6,-8; K3 -1.6,-7.2; K4 -1.6,-6.4; K5 -1.6,-5.6; K8 -1.6,-3.2; K9 -1.6,-2.4; K10 -1.6,-1.6; K11 -1.6,-0.8; K12 -1.6,0; K13 -1.6,0.8; K14 -1.6,1.6; K15 -1.6,2.4; K16 -1.6,3.2; K19 -1.6,5.6; K20 -1.6,6.4; K21 -1.6,7.2; K22 -1.6,8; K23 -1.6,8.8; L1 -0.8,-8.8; L2 -0.8,-8; L3 -0.8,-7.2; L4 -0.8,-6.4; L5 -0.8,-5.6; L8 -0.8,-3.2; L9 -0.8,-2.4; L10 -0.8,-1.6; L11 -0.8,-0.8; L12 -0.8,0; L13 -0.8,0.8; L14 -0.8,1.6; L15 -0.8,2.4; L16 -0.8,3.2; L19 -0.8,5.6; L20 -0.8,6.4; L21 -0.8,7.2; L22 -0.8,8; L23 -0.8,8.8; M1 0,-8.8; M2 0,-8; M3 0,-7.2; M4 0,-6.4; M5 0,-5.6; M8 0,-3.2; M9 0,-2.4; M10 0,-1.6; M11 0,-0.8; M12 0,0; M13 0,0.8; M14 0,1.6; M15 0,2.4; M16 0,3.2; M19 0,5.6; M20 0,6.4; M21 0,7.2; M22 0,8; M23 0,8.8; N1 0.8,-8.8; N2 0.8,-8; N3 0.8,-7.2; N4 0.8,-6.4; N5 0.8,-5.6; N8 0.8,-3.2; N9 0.8,-2.4; N10 0.8,-1.6; N11 0.8,-0.8; N12 0.8,0; N13 0.8,0.8; N14 0.8,1.6; N15 0.8,2.4; N16 0.8,3.2; N19 0.8,5.6; N20 0.8,6.4; N21 0.8,7.2; N22 0.8,8; N23 0.8,8.8; P1 1.6,-8.8; P2 1.6,-8; P3 1.6,-7.2; P4 1.6,-6.4; P5 1.6,-5.6; P8 1.6,-3.2; P9 1.6,-2.4; P10 1.6,-1.6; P11 1.6,-0.8; P12 1.6,0; P13 1.6,0.8; P14 1.6,1.6; P15 1.6,2.4; P16 1.6,3.2; P19 1.6,5.6; P20 1.6,6.4; P21 1.6,7.2; P22 1.6,8; P23 1.6,8.8; R1 2.4,-8.8; R2 2.4,-8; R3 2.4,-7.2; R4 2.4,-6.4; R5 2.4,-5.6; R8 2.4,-3.2; R9 2.4,-2.4; R10 2.4,-1.6; R11 2.4,-0.8; R12 2.4,0; R13 2.4,0.8; R14 2.4,1.6; R15 2.4,2.4; R16 2.4,3.2; R19 2.4,5.6; R20 2.4,6.4; R21 2.4,7.2; R22 2.4,8; R23 2.4,8.8; T1 3.2,-8.8; T2 3.2,-8; T3 3.2,-7.2; T4 3.2,-6.4; T5 3.2,-5.6; T8 3.2,-3.2; T9 3.2,-2.4; T10 3.2,-1.6; T11 3.2,-0.8; T12 3.2,0; T13 3.2,0.8; T14 3.2,1.6; T15 3.2,2.4; T16 3.2,3.2; T19 3.2,5.6; T20 3.2,6.4; T21 3.2,7.2; T22 3.2,8; T23 3.2,8.8; U1 4,-8.8; U2 4,-8; U3 4,-7.2; U4 4,-6.4; U5 4,-5.6; U19 4,5.6; U20 4,6.4; U21 4,7.2; U22 4,8; U23 4,8.8; V1 4.8,-8.8; V2 4.8,-8; V3 4.8,-7.2; V4 4.8,-6.4; V5 4.8,-5.6; V19 4.8,5.6; V20 4.8,6.4; V21 4.8,7.2; V22 4.8,8; V23 4.8,8.8; W1 5.6,-8.8; W2 5.6,-8; W3 5.6,-7.2; W4 5.6,-6.4; W5 5.6,-5.6; W6 5.6,-4.8; W7 5.6,-4; W8 5.6,-3.2; W9 5.6,-2.4; W10 5.6,-1.6; W11 5.6,-0.8; W12 5.6,0; W13 5.6,0.8; W14 5.6,1.6; W15 5.6,2.4; W16 5.6,3.2; W17 5.6,4; W18 5.6,4.8; W19 5.6,5.6; W20 5.6,6.4; W21 5.6,7.2; W22 5.6,8; W23 5.6,8.8; Y1 6.4,-8.8; Y2 6.4,-8; Y3 6.4,-7.2; Y4 6.4,-6.4; Y5 6.4,-5.6; Y6 6.4,-4.8; Y7 6.4,-4; Y8 6.4,-3.2; Y9 6.4,-2.4; Y10 6.4,-1.6; Y11 6.4,-0.8; Y12 6.4,0; Y13 6.4,0.8; Y14 6.4,1.6; Y15 6.4,2.4; Y16 6.4,3.2; Y17 6.4,4; Y18 6.4,4.8; Y19 6.4,5.6; Y20 6.4,6.4; Y21 6.4,7.2; Y22 6.4,8; Y23 6.4,8.8 | smd 0.6 x 0.6: FID1 -9.6,9.6; FID2 9.6,9.6; FID3 9.6,-9.6
FBGA96_SK = smd 0.4 x 0.4: A1 -6,-3.2; A2 -6,-2.4; A3 -6,-1.6; A7 -6,1.6; A8 -6,2.4; A9 -6,3.2; B1 -5.2,-3.2; B2 -5.2,-2.4; B3 -5.2,-1.6; B7 -5.2,1.6; B8 -5.2,2.4; B9 -5.2,3.2; C1 -4.4,-3.2; C2 -4.4,-2.4; C3 -4.4,-1.6; C7 -4.4,1.6; C8 -4.4,2.4; C9 -4.4,3.2; D1 -3.6,-3.2; D2 -3.6,-2.4; D3 -3.6,-1.6; D7 -3.6,1.6; D8 -3.6,2.4; D9 -3.6,3.2; E1 -2.8,-3.2; E2 -2.8,-2.4; E3 -2.8,-1.6; E7 -2.8,1.6; E8 -2.8,2.4; E9 -2.8,3.2; F1 -2,-3.2; F2 -2,-2.4; F3 -2,-1.6; F7 -2,1.6; F8 -2,2.4; F9 -2,3.2; G1 -1.2,-3.2; G2 -1.2,-2.4; G3 -1.2,-1.6; G7 -1.2,1.6; G8 -1.2,2.4; G9 -1.2,3.2; H1 -0.4,-3.2; H2 -0.4,-2.4; H3 -0.4,-1.6; H7 -0.4,1.6; H8 -0.4,2.4; H9 -0.4,3.2; J1 0.4,-3.2; J2 0.4,-2.4; J3 0.4,-1.6; J7 0.4,1.6; J8 0.4,2.4; J9 0.4,3.2; K1 1.2,-3.2; K2 1.2,-2.4; K3 1.2,-1.6; K7 1.2,1.6; K8 1.2,2.4; K9 1.2,3.2; L1 2,-3.2; L2 2,-2.4; L3 2,-1.6; L7 2,1.6; L8 2,2.4; L9 2,3.2; M1 2.8,-3.2; M2 2.8,-2.4; M3 2.8,-1.6; M7 2.8,1.6; M8 2.8,2.4; M9 2.8,3.2; N1 3.6,-3.2; N2 3.6,-2.4; N3 3.6,-1.6; N7 3.6,1.6; N8 3.6,2.4; N9 3.6,3.2; P1 4.4,-3.2; P2 4.4,-2.4; P3 4.4,-1.6; P7 4.4,1.6; P8 4.4,2.4; P9 4.4,3.2; R1 5.2,-3.2; R2 5.2,-2.4; R3 5.2,-1.6; R7 5.2,1.6; R8 5.2,2.4; R9 5.2,3.2; T1 6,-3.2; T2 6,-2.4; T3 6,-1.6; T7 6,1.6; T8 6,2.4; T9 6,3.2 | smd 0.6 x 0.6: FID1 6.5,-4.7; FID2 -6.5,4.7
TSOP48 = smd 1.2 x 0.25: 1 -9.9,5.75; 2 -9.9,5.25; 3 -9.9,4.75; 4 -9.9,4.25; 5 -9.9,3.75; 6 -9.9,3.25; 7 -9.9,2.75; 8 -9.9,2.25; 9 -9.9,1.75; 10 -9.9,1.25; 11 -9.9,0.75; 12 -9.9,0.25; 13 -9.9,-0.25; 14 -9.9,-0.75; 15 -9.9,-1.25; 16 -9.9,-1.75; 17 -9.9,-2.25; 18 -9.9,-2.75; 19 -9.9,-3.25; 20 -9.9,-3.75; 21 -9.9,-4.25; 22 -9.9,-4.75; 23 -9.9,-5.25; 24 -9.9,-5.75; 25 9.9,-5.75; 26 9.9,-5.25; 27 9.9,-4.75; 28 9.9,-4.25; 29 9.9,-3.75; 30 9.9,-3.25; 31 9.9,-2.75; 32 9.9,-2.25; 33 9.9,-1.75; 34 9.9,-1.25; 35 9.9,-0.75; 36 9.9,-0.25; 37 9.9,0.25; 38 9.9,0.75; 39 9.9,1.25; 40 9.9,1.75; 41 9.9,2.25; 42 9.9,2.75; 43 9.9,3.25; 44 9.9,3.75; 45 9.9,4.25; 46 9.9,4.75; 47 9.9,5.25; 48 9.9,5.75

### Placement (x,y rotation side)
C1  -33.02,2.54 0 top  (outside the outline)
C2  -36.83,2.54 0 top  (outside the outline)
C3  -40.64,2.54 0 top  (outside the outline)
C4  -44.45,2.54 0 top  (outside the outline)
C5  -44.45,-2.54 0 top  (outside the outline)
C6  -40.64,-2.54 0 top  (outside the outline)
C7  -44.45,-6.35 0 top  (outside the outline)
C8  -40.64,-6.35 0 top  (outside the outline)
C9  -48.26,-6.35 0 top  (outside the outline)
C10  -48.26,-10.16 0 top  (outside the outline)
C11  -44.45,-10.16 0 top  (outside the outline)
C12  -40.64,-10.16 0 top  (outside the outline)
C13  -48.26,-13.97 0 top  (outside the outline)
C14  -44.45,-13.97 0 top  (outside the outline)
C15  -40.64,-13.97 0 top  (outside the outline)
C16  -48.26,-17.78 0 top  (outside the outline)
C17  -44.45,-17.78 0 top  (outside the outline)
C18  -40.64,-17.78 0 top  (outside the outline)
C19  -55.88,-17.78 0 top  (outside the outline)
C20  -55.88,-21.59 0 top  (outside the outline)
C21  -55.88,-29.21 0 top  (outside the outline)
C22  -52.07,-29.21 0 top  (outside the outline)
C23  -55.88,-40.64 0 top  (outside the outline)
C24  -52.07,-40.64 0 top  (outside the outline)
C25  -48.26,-40.64 0 top  (outside the outline)
C26  -44.45,-40.64 0 top  (outside the outline)
C27  -55.88,-44.45 0 top  (outside the outline)
C28  -52.07,-44.45 0 top  (outside the outline)
C29  -48.26,-44.45 0 top  (outside the outline)
C30  -44.45,-44.45 0 top  (outside the outline)
C31  -55.88,-48.26 0 top  (outside the outline)
C32  -52.07,-48.26 0 top  (outside the outline)
C33  -48.26,-48.26 0 top  (outside the outline)
C34  -44.45,-48.26 0 top  (outside the outline)
C35  -55.88,-52.07 0 top  (outside the outline)
C36  -52.07,-52.07 0 top  (outside the outline)
C37  -48.26,-52.07 0 top  (outside the outline)
C38  -44.45,-52.07 0 top  (outside the outline)
C39  -55.88,-55.88 0 top  (outside the outline)
C40  -52.07,-55.88 0 top  (outside the outline)
R1  -52.07,-17.78 0 top  (outside the outline)
R2  -55.88,-25.4 0 top  (outside the outline)
R3  -55.88,-33.02 0 top  (outside the outline)
R4  -52.07,-33.02 0 top  (outside the outline)
R5  -55.88,-36.83 0 top  (outside the outline)
R6  -55.88,-59.69 0 top  (outside the outline)
R7  -55.88,-63.5 0 top  (outside the outline)
R8  45.9,41.35 0 top
R9  45.9,42.33 0 top
SATA  -21.59,33.02 0 top  (outside the outline)
U1  34.3,36.8 90 top
U2  54.67,43.75 0 top
U3  54.67,32.88 0 top
U4  15.24,36.83 270 top

### Tracks (layer width: path | path; a pad name or v marks a point on that pad's centre or on a via)
1.5V  (via drill 0.25, 0.25 pad 0.46)  (76 unrouted)
  Top 0.127: v47.77,46.2 48.62,46.2 U2.A8 | U2.B2 v49.08,40.95 | U2.D2 v50.67,40.95 | U2.C1 v50.67,40.15 | U2.F1 v52.27,40.95 | U2.A1 v48.27,40.95 | U2.C9 v49.88,47.35 | U2.D9 v50.67,47.35 | U2.E9 v51.48,47.35 | U2.H9 v54.67,47.35 | U2.K8 55.48,46.55 v55.48,47.35 | U2.G7 v53.08,45.75 | U2.R1 v60.27,40.95 | U2.N1 v58.67,40.95 | U2.K2 v55.48,40.95 | U2.H2 v54.67,41.75 | U3.G7 v53.08,34.08 | U3.E9 51.88,36.55 v51.7,36.73 | U3.D9 v50.67,36.48 | U3.C9 v49.88,36.48 | U3.A8 v48.27,35.67 | U3.F1 v52.27,30.07 | U3.H2 v54.67,30.07 | U3.D2 v50.67,30.88 | U3.C1 v49.88,30.07 | U3.B2 v49.08,30.88 | U3.A1 v48.27,30.07 | U3.R9 v60.27,35.67 | U3.N9 v58.67,35.67 | U3.K8 v56.27,34.88 | U3.H9 v53.88,35.67 | U3.K2 v55.48,30.88 | U3.R1 v59.48,29.27 | U3.N1 v57.88,29.27 | U2.R9 v59.48,47.35 | U2.N9 v57.88,47.35
!CAS  (via drill 0.25, 0.25 pad 0.46)  (1 unrouted)
  Top 0.127: U1.U3 v41.9,40.4 | U2.K3 v55.48,42.55 | U3.K3 v54.67,32.48
  Route2 0.127: v55.48,42.55 55.08,42.15 49.67,42.15 48.67,41.15 48.67,40.7 49.73,39.65 53.23,39.65 53.8,40.23 54.25,40.23 54.38,40.1 54.38,39.83 v53.9,39.35 54,39.25 54,38.75 53.52,38.27 50.7,38.27 50.58,38.15 50.58,37.27 50.7,37.15 53.83,37.15 53.98,37 53.98,36.3 53.85,36.17 53.6,36.17 53.48,36.05 53.48,35.27 53.6,35.15 53.85,35.15 53.98,35.02 53.98,34.77 53.85,34.65 53.6,34.65 53.48,34.52 53.48,33.62 53.6,33.5 53.85,33.5 53.98,33.38 53.98,32.9 54.4,32.48 v54.67,32.48
!CS  (via drill 0.25, 0.25 pad 0.46)  (2 unrouted)
  Top 0.127: U1.V3 v41.9,41.2 | U2.L2 v57.08,41.75 | U3.L2 v57.08,30.88
!DDR3_RESET  (via drill 0.25, 0.25 pad 0.46)  (3 unrouted)
  Top 0.127: U1.AA6 v39.5,44.4 | U3.T2 60.83,30.48 v61.27,30.93
!RAS  (via drill 0.25, 0.25 pad 0.46)  (1 unrouted)
  Top 0.127: U1.T4 v41.1,39.6 | U2.J3 v55.48,41.75 | U3.J3 v54.67,31.68
  Route2 0.127: v55.48,41.75 55.08,41.35 49.67,41.35 49.48,41.15 49.48,40.67 49.6,40.55 54.5,40.55 55,40.05 55,39.73 v54.62,39.35 54.25,38.98 54.25,38.65 53.62,38.02 50.95,38.02 50.83,37.9 50.83,37.52 50.95,37.4 53.92,37.4 54.27,37.05 54.27,33.45 55.08,32.65 55.08,32.08 v54.67,31.68
!WE  (via drill 0.25, 0.25 pad 0.46)  (2 unrouted)
  Top 0.127: U1.T3 v41.9,39.6 | U2.L3 v57.08,42.55 | U3.L3 v57.08,31.68
_CLK_N
  Top 0.127: U1.V2 42.7,42 45,42 45.38,42.38 R9.1
_CLK_P
  Top 0.127: U1.V1 43.25,41.75 44.98,41.75 45.4,41.35 R8.1
BA0  (via drill 0.25, 0.25 pad 0.46)  (1 unrouted)
  Top 0.127: U1.K3 v41.9,34.8 | U2.M2 v57.88,41.75 | U3.M2 v57.88,30.88
  Route2 0.127: v57.88,41.75 57.45,41.33 57.02,41.33 56.9,41.2 56.9,40.95 57.02,40.83 57.35,40.83 57.48,40.7 57.48,40.45 57.35,40.33 57.02,40.33 56.9,40.2 56.9,39.95 57.02,39.83 57.83,39.83 57.98,39.67 57.98,38.02 57.85,37.9 57.52,37.9 57.4,37.77 57.4,36.95 v57.88,36.48 57.48,36.08 57.48,33.48 57.6,33.35 58.17,33.35 58.3,33.23 58.3,33.1 58.17,32.98 57.6,32.98 57.48,32.85 57.48,32.73 57.6,32.6 58.17,32.6 58.3,32.48 58.3,32.35 58.17,32.23 57.6,32.23 57.48,32.1 57.48,31.27 v57.88,30.88
BA1  (via drill 0.25, 0.25 pad 0.46)  (1 unrouted)
  Top 0.127: U1.L4 v41.1,35.6 | U2.N8 v58.67,45.75 | U3.N8 v58.67,34.88
  Route2 0.127: v58.67,45.75 58.27,45.35 58.27,37.45 v58.67,37.05 58.27,36.65 58.27,33.8 59,33.08 59,32.3 59.12,32.17 59.9,32.17 60.02,32.3 60.02,32.83 59.08,33.77 59.08,34.48 v58.67,34.88
BA2  (via drill 0.25, 0.25 pad 0.46)  (2 unrouted)
  Top 0.127: U1.K4 v41.1,34.8 | U2.M3 v57.88,42.55 | U3.M3 v57.88,31.68
CKE  (via drill 0.25, 0.25 pad 0.46)  (1 unrouted)
  Top 0.127: U1.N3 v41.9,37.2 | U2.K9 v56.27,46.55 | U3.K9 v56.27,35.67
  Route2 0.127: v56.27,46.55 55.88,46.15 55.88,43.92 55.75,43.8 54.38,43.8 54.25,43.67 54.25,43.4 54.38,43.27 55.75,43.27 55.88,43.15 55.88,39.38 55.38,38.88 55.38,36.58 v55.48,36.48 55.67,36.48 55.88,36.67 55.88,37.67 56.08,37.88 56.48,37.88 56.67,37.67 56.67,32.48 56.48,32.27 56.08,32.27 55.88,32.48 55.88,33.12 55.77,33.23 55.42,33.23 55.3,33.35 55.3,33.48 55.42,33.6 55.75,33.6 55.88,33.73 55.88,35.27 v56.27,35.67
CLK_N  (via drill 0.25)  (2 unrouted)
  Top 0.127: U2.K7 55.85,45.38 55.65,45.38 55.45,45.17 v55.45,44.35 | R9.2 46.82,41.95 47.25,41.95 47.6,41.6 47.6,41.4 | 47.6,41.4 v47.77,41.4 | 47.6,41.4 47.6,40.28 47.73,40.15 48.15,40.15 48.43,39.88 48.43,38.43 48.55,38.3 48.82,38.3 48.95,38.43 48.95,39.88 49.22,40.15 49.7,40.15 49.98,39.88 49.98,37.28 50.1,37.15 50.37,37.15 50.52,37.3 50.52,39.45 50.8,39.73 51.28,39.73 51.58,39.43 51.58,37.53 51.7,37.4 51.97,37.4 52.12,37.55 52.12,39.43 52.4,39.7 52.88,39.7 53.15,39.43 53.15,36.77 v53.09,36.71 | U3.K7 v55.48,34.88
CLK_P  (via drill 0.25)  (2 unrouted)
  Top 0.127: U2.J7 55.1,45.35 55.17,45.27 55.17,44.7 v54.83,44.35 | R8.2 46.8,41.7 47.15,41.7 47.35,41.5 47.35,41.4 | 47.35,41.4 v47.18,41.4 | 47.35,41.4 47.35,40.17 47.62,39.9 48.05,39.9 48.17,39.77 48.17,38.32 48.45,38.05 48.93,38.05 49.2,38.32 49.2,39.77 49.33,39.9 49.6,39.9 49.72,39.77 49.72,37.17 50,36.9 50.48,36.9 50.78,37.2 50.78,39.35 50.9,39.47 51.17,39.47 51.32,39.32 51.32,37.42 51.6,37.15 52.08,37.15 52.38,37.45 52.38,39.32 52.5,39.45 52.77,39.45 52.9,39.32 52.9,37.15 v52.46,36.72 | U3.J7 55.33,34.48 55.48,34.33 v55.48,34.08
CPU_VREF  (3 unrouted)
DDR3_ODT  (via drill 0.25, 0.25 pad 0.46)  (1 unrouted)
  Top 0.127: U1.AA5 v40.3,44.4 | U2.K1 56.27,40.95 56.88,40.95 57.08,40.75 57.08,40.38 57.98,39.48 57.98,37.05 57.85,36.92 57.73,36.92 57.6,37.05 57.6,39.35 56.95,40 55.75,40 55.48,39.73 v55.48,39.58 | U3.K1 v55.48,30.07
  Route2 0.127: v55.48,39.58 55.08,39.17 55.08,33.2 55.62,32.65 55.62,31.75 55.08,31.2 55.08,30.38 55.38,30.07 v55.48,30.07
DDR_VREF  (via drill 0.25)  (4 unrouted)
  Top 0.127: U2.M8 v57.08,46.55 | U2.H1 55.05,39.77 55.05,39.38 55.27,39.15 55.88,39.15 v56.27,39.55 | U3.H1 v53.88,30.07 | U3.M8 v57.08,35.67
  Route2 0.254: v57.08,46.55 57.08,45.05 56.58,44.55 56.58,39.55 | 56.58,39.55 v56.27,39.55 | 56.58,39.55 56.58,38.23 57.08,37.73 v57.08,35.67 57.08,32.4 56.27,31.6 56.27,29.55 54.4,29.55 v53.88,30.07
DQ0  (via drill 0.25, 0.25 pad 0.46)  (1 unrouted)
  Top 0.127: U1.AB4 41.1,45.2 41.1,45.83 43.12,47.85 44.35,47.85 v44.83,47.38 | U2.E3 51.42,42.6 51.12,42.6 v50.6,43.12
DQ1  (via drill 0.25, 0.25 pad 0.46)  (1 unrouted)
  Top 0.127: U1.AC7 38.3,46.27 38.5,46.48 39.27,46.48 39.8,47 41.52,47 42.92,48.4 46.05,48.4 46.25,48.2 46.25,47.2 v46.33,47.12 | U2.F7 v52.27,45.75
DQ2  (via drill 0.25, 0.25 pad 0.46)  (1 unrouted)
  Top 0.127: U1.AC4 40.7,45.8 43.02,48.12 44.92,48.12 v45.25,47.8 | U2.F2 52.27,41.75 52.27,42.35 51.77,42.85 51.52,42.85 v51.25,43.12
DQ3  (via drill 0.25, 0.25 pad 0.46)  (1 unrouted)
  Top 0.127: U1.AB8 v37.9,45.2 | U2.F8 v52.27,46.55
DQ4  (via drill 0.25, 0.25 pad 0.46)  (1 unrouted)
  Top 0.127: U1.AC8 37.5,45.65 v37.88,46.02 | U2.H3 v54.67,42.55
DQ5  (via drill 0.25, 0.25 pad 0.46)  (1 unrouted)
  Top 0.127: U1.AB5 40.3,45.2 40.3,45.8 40.77,46.27 v40.77,46.55 | U2.H8 53.88,45.75 53.88,44.3 53.75,44.17 53.45,44.17 53.33,44.3 53.33,44.83 53.2,44.95 v51.48,44.95
DQ6  (via drill 0.25, 0.25 pad 0.46)  (1 unrouted)
  Top 0.127: U1.AB7 v38.7,45.2 | U2.G2 53.88,41.75 53.88,42.38 53.42,42.83 53.42,43.35 v52.67,44.1
DQ7  (via drill 0.25, 0.25 pad 0.46)  (1 unrouted)
  Top 0.127: U1.AC3 41.5,45.85 43.23,47.58 44,47.58 44.7,46.88 45.45,46.88 v45.7,47.12 | U2.H7 v54.67,45.75
DQ8  (via drill 0.25, 0.25 pad 0.46)  (1 unrouted)
  Top 0.127: U1.AB2 42.5,44.8 42.9,45.2 43.3,45.2 43.5,45 45.9,45 46.65,45.75 47,45.75 47.25,45.5 v47.25,45.42 | U2.D7 v50.67,44.95
DQ9
  Top 0.127: U1.Y1 43.35,43.2 43.75,43.6 45.27,43.6 45.4,43.48 45.4,42.98 45.52,42.83 45.77,42.83 45.9,42.98 45.9,43.23 46.02,43.35 46.27,43.35 46.4,43.23 46.4,42.98 46.52,42.85 46.77,42.85 46.9,42.98 46.9,43.23 47.02,43.35 47.3,43.35 47.42,43.23 47.42,42.17 47.55,42.05 47.67,42.05 47.8,42.17 47.8,43.23 47.92,43.35 48.3,43.35 48.42,43.23 48.42,43 48.55,42.88 48.67,42.88 48.8,43 48.8,43.23 48.92,43.35 49.35,43.35 49.48,43.23 49.48,42.73 49.6,42.6 50.1,42.6 50.27,42.42 U2.C3
DQ10
  Top 0.127: U1.AC2 42.3,46.27 43.33,47.3 43.9,47.3 44.6,46.6 44.6,46.08 44.73,45.95 44.85,45.95 44.98,46.08 44.98,46.42 45.1,46.55 45.23,46.55 45.35,46.42 45.35,46.08 45.48,45.95 45.6,45.95 46.2,46.55 46.7,46.55 46.83,46.67 46.83,47 46.95,47.12 47.08,47.12 47.2,47 47.2,46.67 47.33,46.55 47.45,46.55 47.58,46.67 47.58,47 47.7,47.12 47.83,47.12 47.95,47 47.95,46.67 48.08,46.55 49.88,46.55 U2.C8
DQ11
  Top 0.127: U1.Y2 42.7,43.6 43.38,43.6 43.65,43.88 45.48,43.88 45.73,43.62 48.88,43.62 49,43.75 49,44.12 49.12,44.25 49.25,44.25 49.38,44.12 49.38,43.75 49.5,43.62 49.62,43.62 49.75,43.75 49.75,44.27 49.88,44.4 50,44.4 50.1,44.3 50.1,43 50.67,42.42 50.67,41.75 U2.C2
DQ12
  Top 0.127: U1.AA1 43.38,44 43.52,44.15 45.6,44.15 45.85,43.9 47.1,43.9 47.23,44.02 47.23,44.85 47.35,44.98 47.48,44.98 47.6,44.85 47.6,44.02 47.73,43.9 47.85,43.9 47.98,44.02 47.98,45.15 48.1,45.27 48.23,45.27 48.35,45.15 48.35,44.02 48.48,43.9 48.6,43.9 48.73,44.02 48.73,44.4 48.85,44.52 49.5,44.52 49.62,44.65 49.62,44.77 49.5,44.9 48.8,44.9 48.67,45.02 U2.A7
DQ13  (via drill 0.25, 0.25 pad 0.46)  (1 unrouted)
  Top 0.127: U1.AB3 41.9,45.2 42.5,45.2 42.7,45.4 42.7,46.15 42.83,46.27 43.12,46.27 43.55,45.85 44.3,45.85 44.5,45.65 v44.5,45.42 | U2.A2 49.08,41.75 v49.08,42.55
DQ14  (via drill 0.25 pad 0.46)  (1 unrouted)
  Top 0.127: U1.W2 42.7,42.8 43.33,42.8 43.85,43.33 44.77,43.33 v44.95,43.15 | U2.B8 49.08,45.75 47.6,45.75 47.33,46.02 46.3,46.02 v45.7,45.42
DQ15  (via drill 0.25, 0.25 pad 0.46)  (1 unrouted)
  Top 0.127: U1.AC1 43.12,45.58 43.67,45.58 v43.83,45.42 | U2.A3 v48.27,42.55
DQ16  (via drill 0.25)  (1 unrouted)
  Top 0.127: U3.E3 v51.48,31.68 | U1.N1 43.5,37.6 45.02,36.08 45.02,35.5 v44.85,35.33
DQ17
  Top 0.127: U1.T2 42.7,40.4 43.4,40.4 47.3,36.5 47.3,34.45 48.25,33.5 48.25,32.95 48.55,32.65 52.38,32.65 52.85,33.12 53.75,33.12 53.88,33.25 53.88,33.38 53.75,33.5 52.85,33.5 52.65,33.7 52.65,34.45 U3.F7
DQ18  (via drill 0.25)  (1 unrouted)
  Top 0.127: U3.F2 v52.27,30.88 | U1.N2 42.7,38 43.5,38 45.3,36.2 45.3,35.42 v45.5,35.23
DQ19
  Top 0.127: U1.U1 43.38,40.8 47.58,36.6 47.58,34.55 48.52,33.6 48.52,33.05 48.65,32.92 50.65,32.92 50.77,33.05 50.77,33.58 50.9,33.7 51.02,33.7 51.15,33.58 51.15,33.05 51.27,32.92 51.4,32.92 51.52,33.05 51.52,33.55 51.65,33.67 51.77,33.67 51.9,33.55 51.9,33.05 52.02,32.92 52.15,32.92 52.27,33.05 52.27,34.88 U3.F8
DQ20  (via drill 0.25)  (1 unrouted)
  Top 0.127: U1.U2 42.7,41.2 43.35,41.2 47.85,36.7 47.85,34.65 48.98,33.52 v49.42,33.52 | U3.H3 54.23,31.32 v54.23,32.1
DQ21  (via drill 0.25)  (1 unrouted)
  Top 0.127: U1.P1 43.5,38.4 45.58,36.33 45.58,35.8 46.2,35.17 v46.2,33.77 | U3.H8 53.88,34.88 v53.88,34.08
DQ22
  Top 0.127: U1.T1 43.4,40 47.02,36.38 47.02,34.35 47.98,33.4 47.98,32.85 48.45,32.38 51.95,32.38 52.08,32.25 52.08,31.85 52.2,31.73 52.33,31.73 52.45,31.85 52.45,32.27 53.02,32.85 53.48,32.85 53.73,32.6 53.73,31.82 53.88,31.68 53.88,30.88 U3.G2
DQ23  (via drill 0.25)  (1 unrouted)
  Top 0.127: U1.M2 42.7,37.2 43.52,37.2 44.6,36.12 v44.6,35.88 | U3.H7 v54.67,34.08
DQ24  (via drill 0.25)  (1 unrouted)
  Top 0.127: U3.D7 v50.67,34.88 | U1.L1 43.48,36 v43.73,35.75
DQ25  (via drill 0.25)  (1 unrouted)
  Top 0.127: U3.C3 v49.88,31.68 | U1.H1 43.2,33.5 v44.17,33.5
DQ26  (via drill 0.25)  (1 unrouted)
  Top 0.127: U3.C8 v49.88,35.67 | U1.L2 v42.7,36.4
DQ27  (via drill 0.25)  (1 unrouted)
  Top 0.127: U3.C2 v49.88,30.88 | U1.H2 v42.7,34
DQ28  (via drill 0.25)  (1 unrouted)
  Top 0.127: U3.A7 v49.08,34.08 | U1.J1 43.3,34.4 43.42,34.27 43.42,33.9 43.55,33.77 43.67,33.77 43.8,33.9 43.8,34.42 43.92,34.55 44.05,34.55 44.17,34.42 44.17,34.23 44.3,34.1 v44.5,34.1
DQ29  (via drill 0.25)  (1 unrouted)
  Top 0.127: U3.A2 v48.27,30.88 | U1.M1 43.55,36.8 44.15,36.2 44.15,35.42 45.55,34.02 v45.55,32.75
DQ30  (via drill 0.25)  (1 unrouted)
  Top 0.127: U3.B8 v49.08,35.67 | U1.G2 42.7,33.2 43.35,33.2 43.48,33.08 v44.6,33.08
DQ31  (via drill 0.25)  (1 unrouted)
  Top 0.127: U3.A3 v48.27,31.68 | U1.K2 42.7,35.6 43.27,35.6 43.58,35.3 43.9,35.3 44.92,34.27 v44.92,33.58
GND  (via drill 0.25)  (86 unrouted)
  Top 0.127: U2.B3 v49.88,41.75 | U2.B1 v49.88,40.95 | U2.E2 v51.48,40.95 | U2.D1 v51.48,40.15 | U2.E1 v52.27,40.15 | U2.G1 v53.08,40.15 | U2.A9 v48.27,47.35 | U2.B9 v49.08,47.35 | U2.F9 v53.08,47.35 | U2.G9 v53.88,47.35 | U2.J8 v54.67,46.55 | U2.G8 v53.08,46.55 | U2.E8 v51.48,46.55 | U2.D8 v50.67,46.55 | U2.P1 v59.48,40.95 | U2.M1 v57.88,40.95 | U2.J2 v54.67,40.95 | U3.D8 v51.48,34.88 | U3.E8 v51.48,35.67 | U3.F9 v52.27,35.67 | U3.G8 v53.08,34.88 | U3.G9 v53.08,35.67 | U3.B9 v49.08,36.48 | U3.A9 v48.27,36.48 | U3.G1 v53.08,30.07 | U3.E1 v51.48,30.07 | U3.E2 v51.48,30.88 | U3.D1 v50.67,30.07 | U3.B1 v49.08,30.07 | U3.B3 v49.08,31.68 | U3.T9 v61.08,35.67 | U3.P9 v59.48,35.67 | U3.M9 v57.88,35.67 | U3.J2 v54.67,30.88 | U3.T1 v61.08,30.07 | U3.P1 v58.67,29.27 | U3.M1 v57.08,29.27 | U2.P9 v58.67,47.35 | U2.M9 v57.08,47.35 | U2.T9 60.8,46.95 v61.35,46.4
N$1  (via drill 0.25)  (1 unrouted)
  Top 0.127: U2.L8 57.08,45.75 v57.88,45.75
N$2  (via drill 0.25)  (1 unrouted)
  Top 0.127: U3.L8 57.08,34.88 v57.88,34.88
SA0  (via drill 0.25, 0.25 pad 0.46)  (2 unrouted)
  Top 0.127: U1.W4 v41.1,42 | U2.N3 v58.67,42.55 | U3.N3 v58.67,31.68
SA1  (via drill 0.25, 0.25 pad 0.46)  (2 unrouted)
  Top 0.127: U1.R4 v41.1,38.8 | U2.P7 v59.48,44.95 | U3.P7 v59.48,34.08
SA2  (via drill 0.25, 0.25 pad 0.46)  (2 unrouted)
  Top 0.127: U1.U4 v41.1,40.4 | U2.P3 v59.48,42.55 | U3.P3 v59.48,31.68
SA3  (via drill 0.25, 0.25 pad 0.46)  (2 unrouted)
  Top 0.127: U1.M4 v41.1,36.4 | U2.N2 v58.67,41.75 | U3.N2 v58.67,30.88
SA4  (via drill 0.25, 0.25 pad 0.46)  (1 unrouted)
  Top 0.127: U1.Y4 v41.1,42.8 | U2.P8 v59.48,45.75 | U3.P8 v59.48,34.88
  Route2 0.127: v59.48,45.75 59.48,46.38 59.6,46.5 60.75,46.5 60.88,46.62 60.88,46.75 60.75,46.88 59.35,46.88 59.08,46.6 59.08,43.55 v59.48,43.15 59.08,42.75 U3.P8 v59.48,34.88
SA5  (via drill 0.25, 0.25 pad 0.46)  (2 unrouted)
  Top 0.127: U1.N4 v41.1,37.2 | U2.P2 v59.48,41.75 | U3.P2 v59.48,30.07
SA6  (via drill 0.25, 0.25 pad 0.46)  (1 unrouted)
  Top 0.127: U1.V4 v41.1,41.2 | U2.R8 v60.27,45.75 | U3.R8 v60.27,34.88
  Route2 0.127: v60.27,45.75 59.88,45.35 59.88,39.55 v60.27,39.15 60.27,39.02 60.4,38.9 60.4,38.77 60.27,38.65 59.75,38.65 59.62,38.52 59.62,38.4 59.75,38.27 60.27,38.27 60.4,38.15 60.4,38.02 60.27,37.9 60,37.9 59.88,37.77 59.88,37 59.75,36.88 59.48,36.88 59.35,36.75 59.35,36.62 59.48,36.5 60.25,36.5 60.38,36.38 60.38,36.25 60.25,36.12 60,36.12 59.88,36 U3.R8 v60.27,34.88
SA7  (via drill 0.25, 0.25 pad 0.46)  (1 unrouted)
  Top 0.127: U1.M3 v41.9,36.4 | U2.R2 v60.27,41.75 | U3.R2 v60.27,30.07
  Route2 0.127: v60.27,30.07 60.67,30.48 60.67,36.88 v60.27,37.27 60.67,37.67 60.67,38.45 60.8,38.58 61.27,38.58 61.4,38.7 61.4,38.83 61.27,38.95 60.8,38.95 60.67,39.08 60.67,41.35 v60.27,41.75
SA8  (via drill 0.25, 0.25 pad 0.46)  (1 unrouted)
  Top 0.127: U1.AA3 v41.9,43.6 | U2.T8 v61.08,45.75 | U3.T8 v61.08,34.88
  Route2 0.127: v61.08,45.75 61.65,45.17 61.65,44.62 61.52,44.5 60.25,44.5 60.12,44.38 60.12,44.25 60.25,44.12 61.52,44.12 61.65,44 61.65,43.88 61.52,43.75 60.25,43.75 60.12,43.62 60.12,43.5 60.25,43.38 60.75,43.38 v60.95,43.17 61.05,43.17 61.65,42.58 61.65,35.45 v61.08,34.88
SA9  (via drill 0.25, 0.25 pad 0.46)  (2 unrouted)
  Top 0.127: U1.P4 v41.1,38 | U2.R3 v60.27,42.55 | U3.R3 v60.27,31.68
SA10  (via drill 0.25, 0.25 pad 0.46)  (2 unrouted)
  Top 0.127: U1.L3 v41.9,35.6 | U2.L7 v56.27,45.75 | U3.L7 v56.27,34.08
SA11  (via drill 0.25, 0.25 pad 0.46)  (2 unrouted)
  Top 0.127: U1.W3 v41.9,42 | U2.R7 v60.27,44.95 | U3.R7 v60.27,34.08
SA12  (via drill 0.25, 0.25 pad 0.46)  (2 unrouted)
  Top 0.127: U1.P3 v41.9,38 | U2.N7 v58.67,44.95 | U3.N7 v58.67,34.08
SA13  (via drill 0.25, 0.25 pad 0.46)  (2 unrouted)
  Top 0.127: U1.Y3 v41.9,42.8 | U2.T3 v61.08,42.55 | U3.T3 60.98,31.57 v61.27,31.57
SA14  (via drill 0.25, 0.25 pad 0.46)  (2 unrouted)
  Top 0.127: U1.R3 v41.9,38.8 | U2.T7 v61.08,44.95 | U3.T7 v61.08,34.08
SA15  (via drill 0.25, 0.25 pad 0.46)  (2 unrouted)
  Top 0.127: U1.AA4 v41.1,43.6 | U2.M7 v57.88,44.95 | U3.M7 v57.88,34.08
SDQM0  (via drill 0.25, 0.25 pad 0.46)  (1 unrouted)
  Top 0.127: U1.AC6 39.1,45.65 v38.73,46.02 | U2.E7 v51.48,45.75
SDQM1  (via drill 0.25, 0.25 pad 0.46)  (1 unrouted)
  Top 0.127: U1.W1 43.33,42.4 43.65,42.73 v44.5,42.73 | U2.D3 v51.48,41.75
SDQM2  (via drill 0.25)  (1 unrouted)
  Top 0.127: U3.E7 v51.48,34.08 | U1.R2 42.7,39.6 43.42,39.6 46.58,36.45 v46.58,36.17
SDQM3
  Top 0.127: U1.G1 44.08,32.8 44.9,31.98 44.9,31.52 45.02,31.4 45.27,31.4 45.4,31.52 45.4,31.85 45.52,31.98 45.9,31.98 46.02,32.1 46.02,32.85 46.15,32.98 46.4,32.98 46.52,32.85 46.52,32.1 46.65,31.98 46.9,31.98 47.02,32.1 47.02,32.62 47.15,32.75 47.4,32.75 47.52,32.62 47.52,32.23 47.65,32.1 50.42,32.1 51.08,31.45 U3.D3
SDQS0+  (via drill 0.25, 0.25 pad 0.46)  (1 unrouted)
  Top 0.127: U1.AB6 39.5,45.2 v39.5,46 | U2.F3 52.67,42.58 v52.15,43.1
SDQS0-  (via drill 0.25, 0.25 pad 0.46)  (1 unrouted)
  Top 0.127: U1.AC5 39.95,45.65 39.95,46.19 v40.04,46.27 | U2.G3 52.77,42.85 v52.77,43.1
SDQS1+  (via drill 0.25, 0.25 pad 0.46)  (1 unrouted)
  Top 0.127: U1.AB1 43.17,44.73 45.98,44.73 46.02,44.77 46.58,44.77 46.77,44.58 v46.77,44.35 | U2.C7 v50.67,45.75
SDQS1-  (via drill 0.25, 0.25 pad 0.46)  (1 unrouted)
  Top 0.127: U1.AA2 42.7,44.4 43.35,44.4 43.4,44.45 46.08,44.45 v46.17,44.35 | U2.B7 v49.88,45.75
SDQS2+  (via drill 0.25)  (1 unrouted)
  Top 0.127: U3.F3 52.77,31.38 52.77,31.98 v53.2,32.4 | U1.R1 43.45,39.2 46.12,36.52 46.12,36 46.75,35.38 46.75,34.25 47.12,33.88 47.12,33.65 v47.48,33.3
SDQS2-  (via drill 0.25)  (1 unrouted)
  Top 0.127: U3.G3 53.23,31.52 v53.23,31.77 | U1.P2 42.7,38.8 43.48,38.8 45.85,36.42 45.85,35.9 46.48,35.27 46.48,34.15 46.85,33.77 v46.85,33.3
SDQS3+  (via drill 0.25)  (1 unrouted)
  Top 0.127: U3.C7 50.3,34.45 50.3,34.05 v50.48,33.88 | U1.K1 43.1,35 43.3,34.8 v43.5,34.8
SDQS3-  (via drill 0.25)  (1 unrouted)
  Top 0.127: U3.B7 v49.88,34.08 | U1.J2 v42.7,34.8
VCC  (1 unrouted)
VSS  (1 unrouted)